# EAGLE design tello_ankle_encoder_and_amplifier-Symmetric (EAGLE 9.6.2)

## Sheet 1 of 6
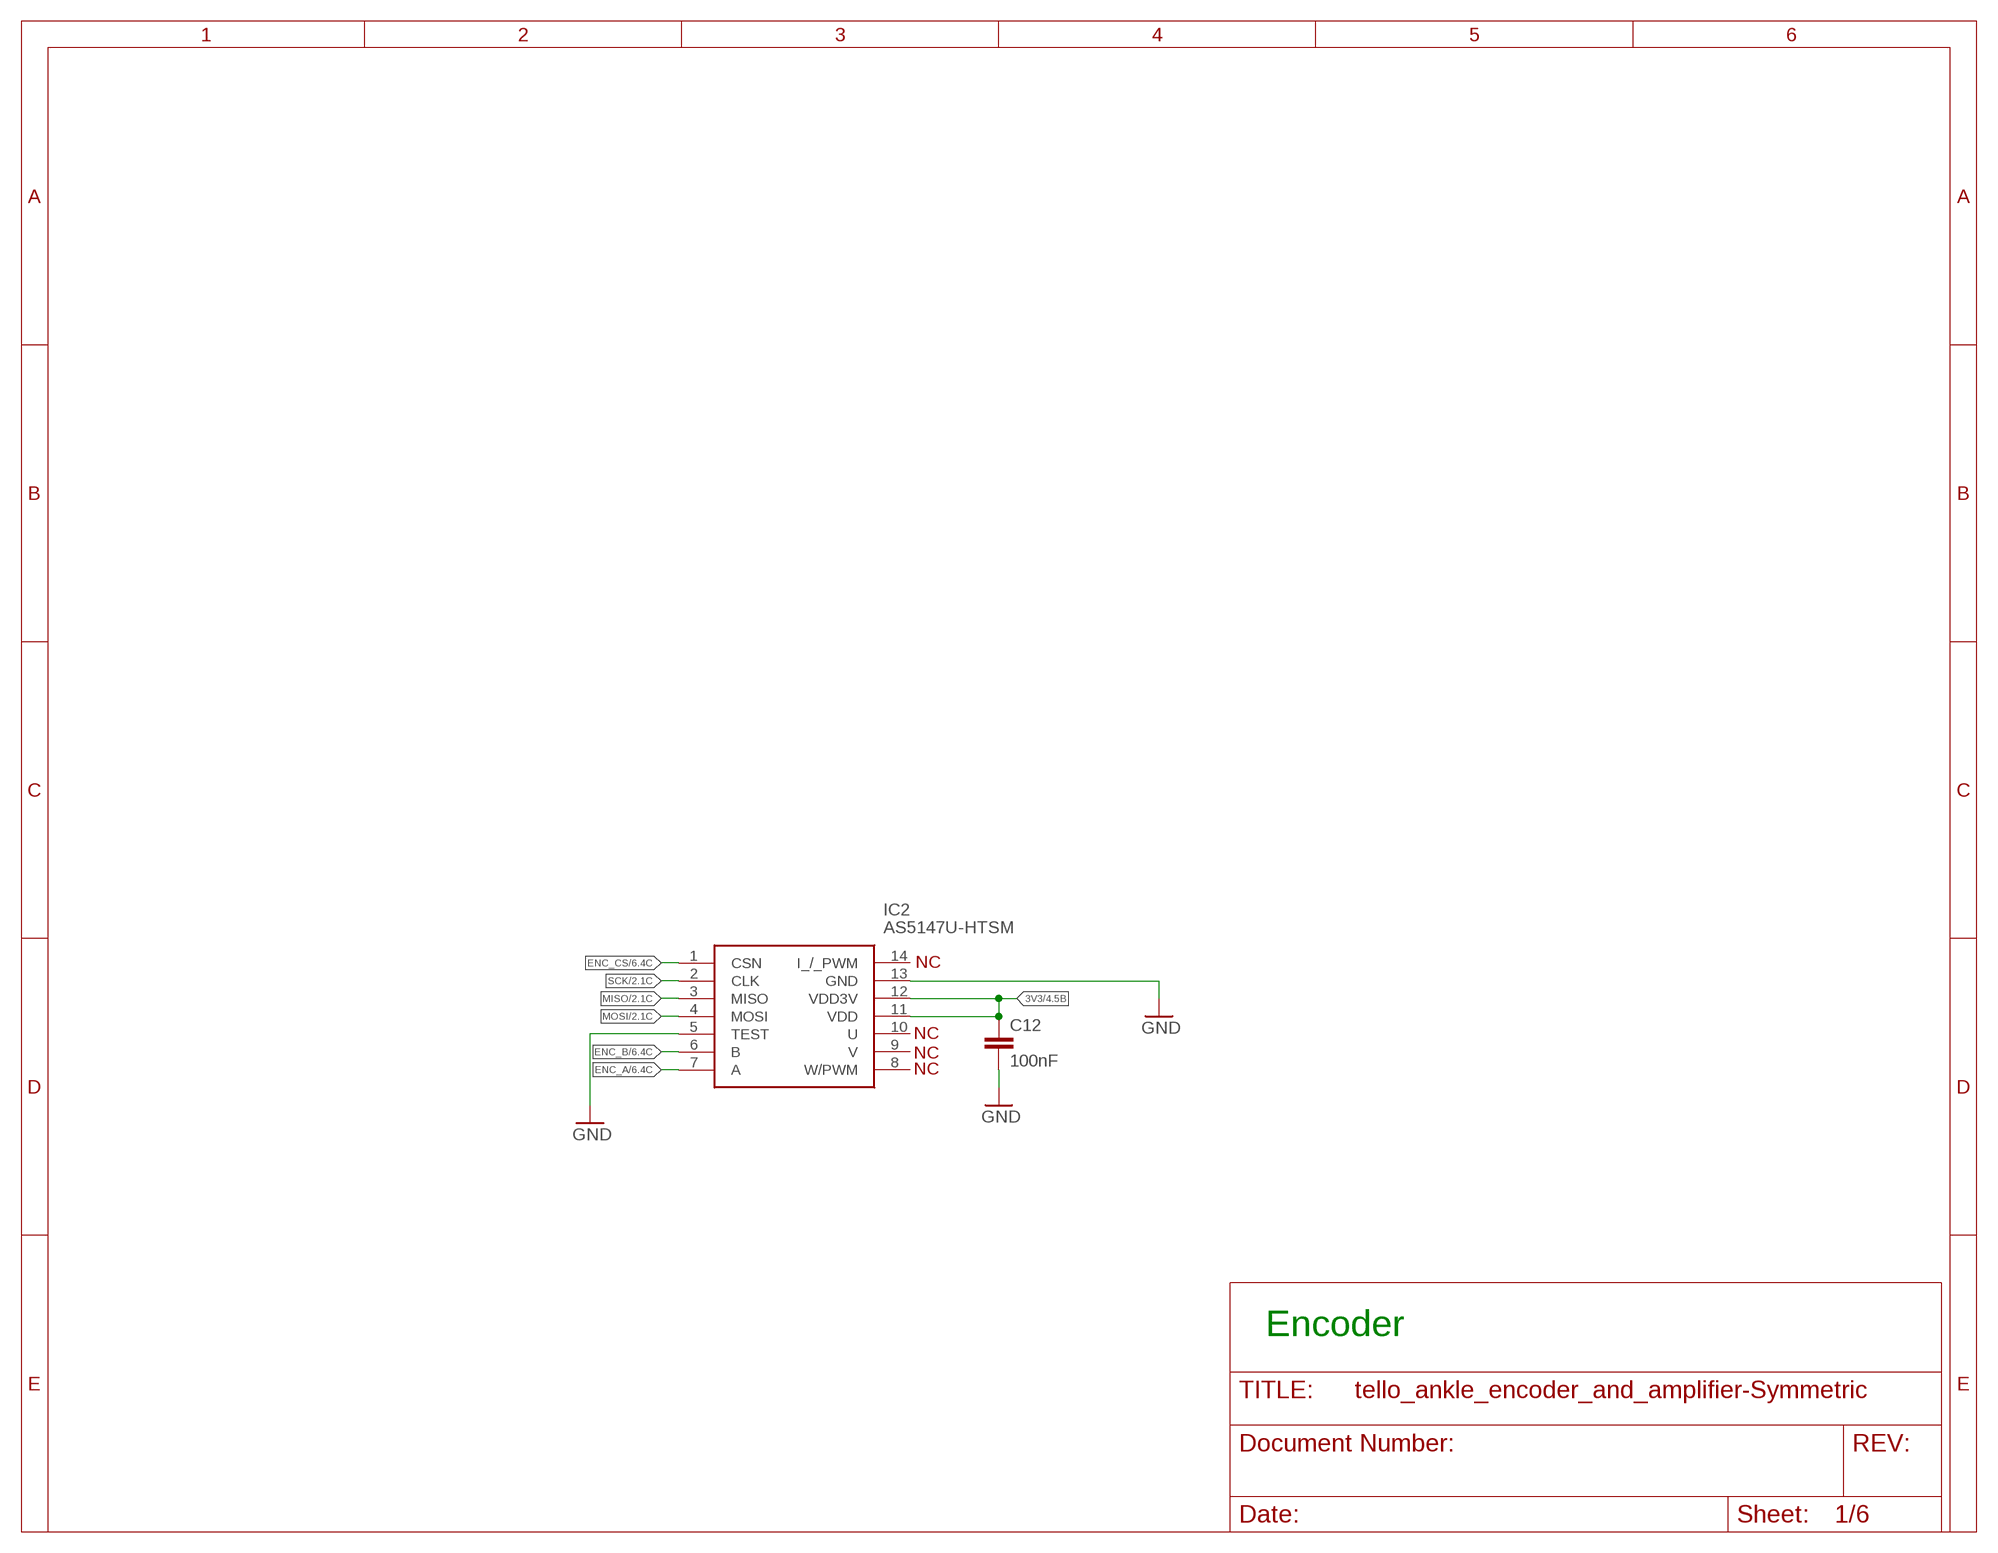
[diagram p0: schematic, sheet 1]

### Parts
C12  100nF  C-EUC0402  [C0402]
IC2  AS5147U-HTSM  [SOP65P640X120-14N]

### Nets
3V3: C12.1 IC2.11(VDD) IC2.12(VDD3V) ; also sheet 2,3,4,5,6
ENC_A: IC2.7(A) ; also sheet 6
ENC_B: IC2.6(B) ; also sheet 6
ENC_CS: IC2.1(CSN) ; also sheet 6
GND: C12.2 IC2.5(TEST) IC2.13(GND) ; also sheet 2,3,4,5,6
MISO: IC2.3(MISO) ; also sheet 2,3,6
MOSI: IC2.4(MOSI) ; also sheet 2,3,6
SCK: IC2.2(CLK) ; also sheet 2,3,6
Unconnected: IC2.8(W/PWM) IC2.9(V) IC2.10(U) IC2.14(I_/_PWM)

### Notes on the sheet
- NC
- NC
- NC
- NC
- Encoder

## Sheet 2 of 6
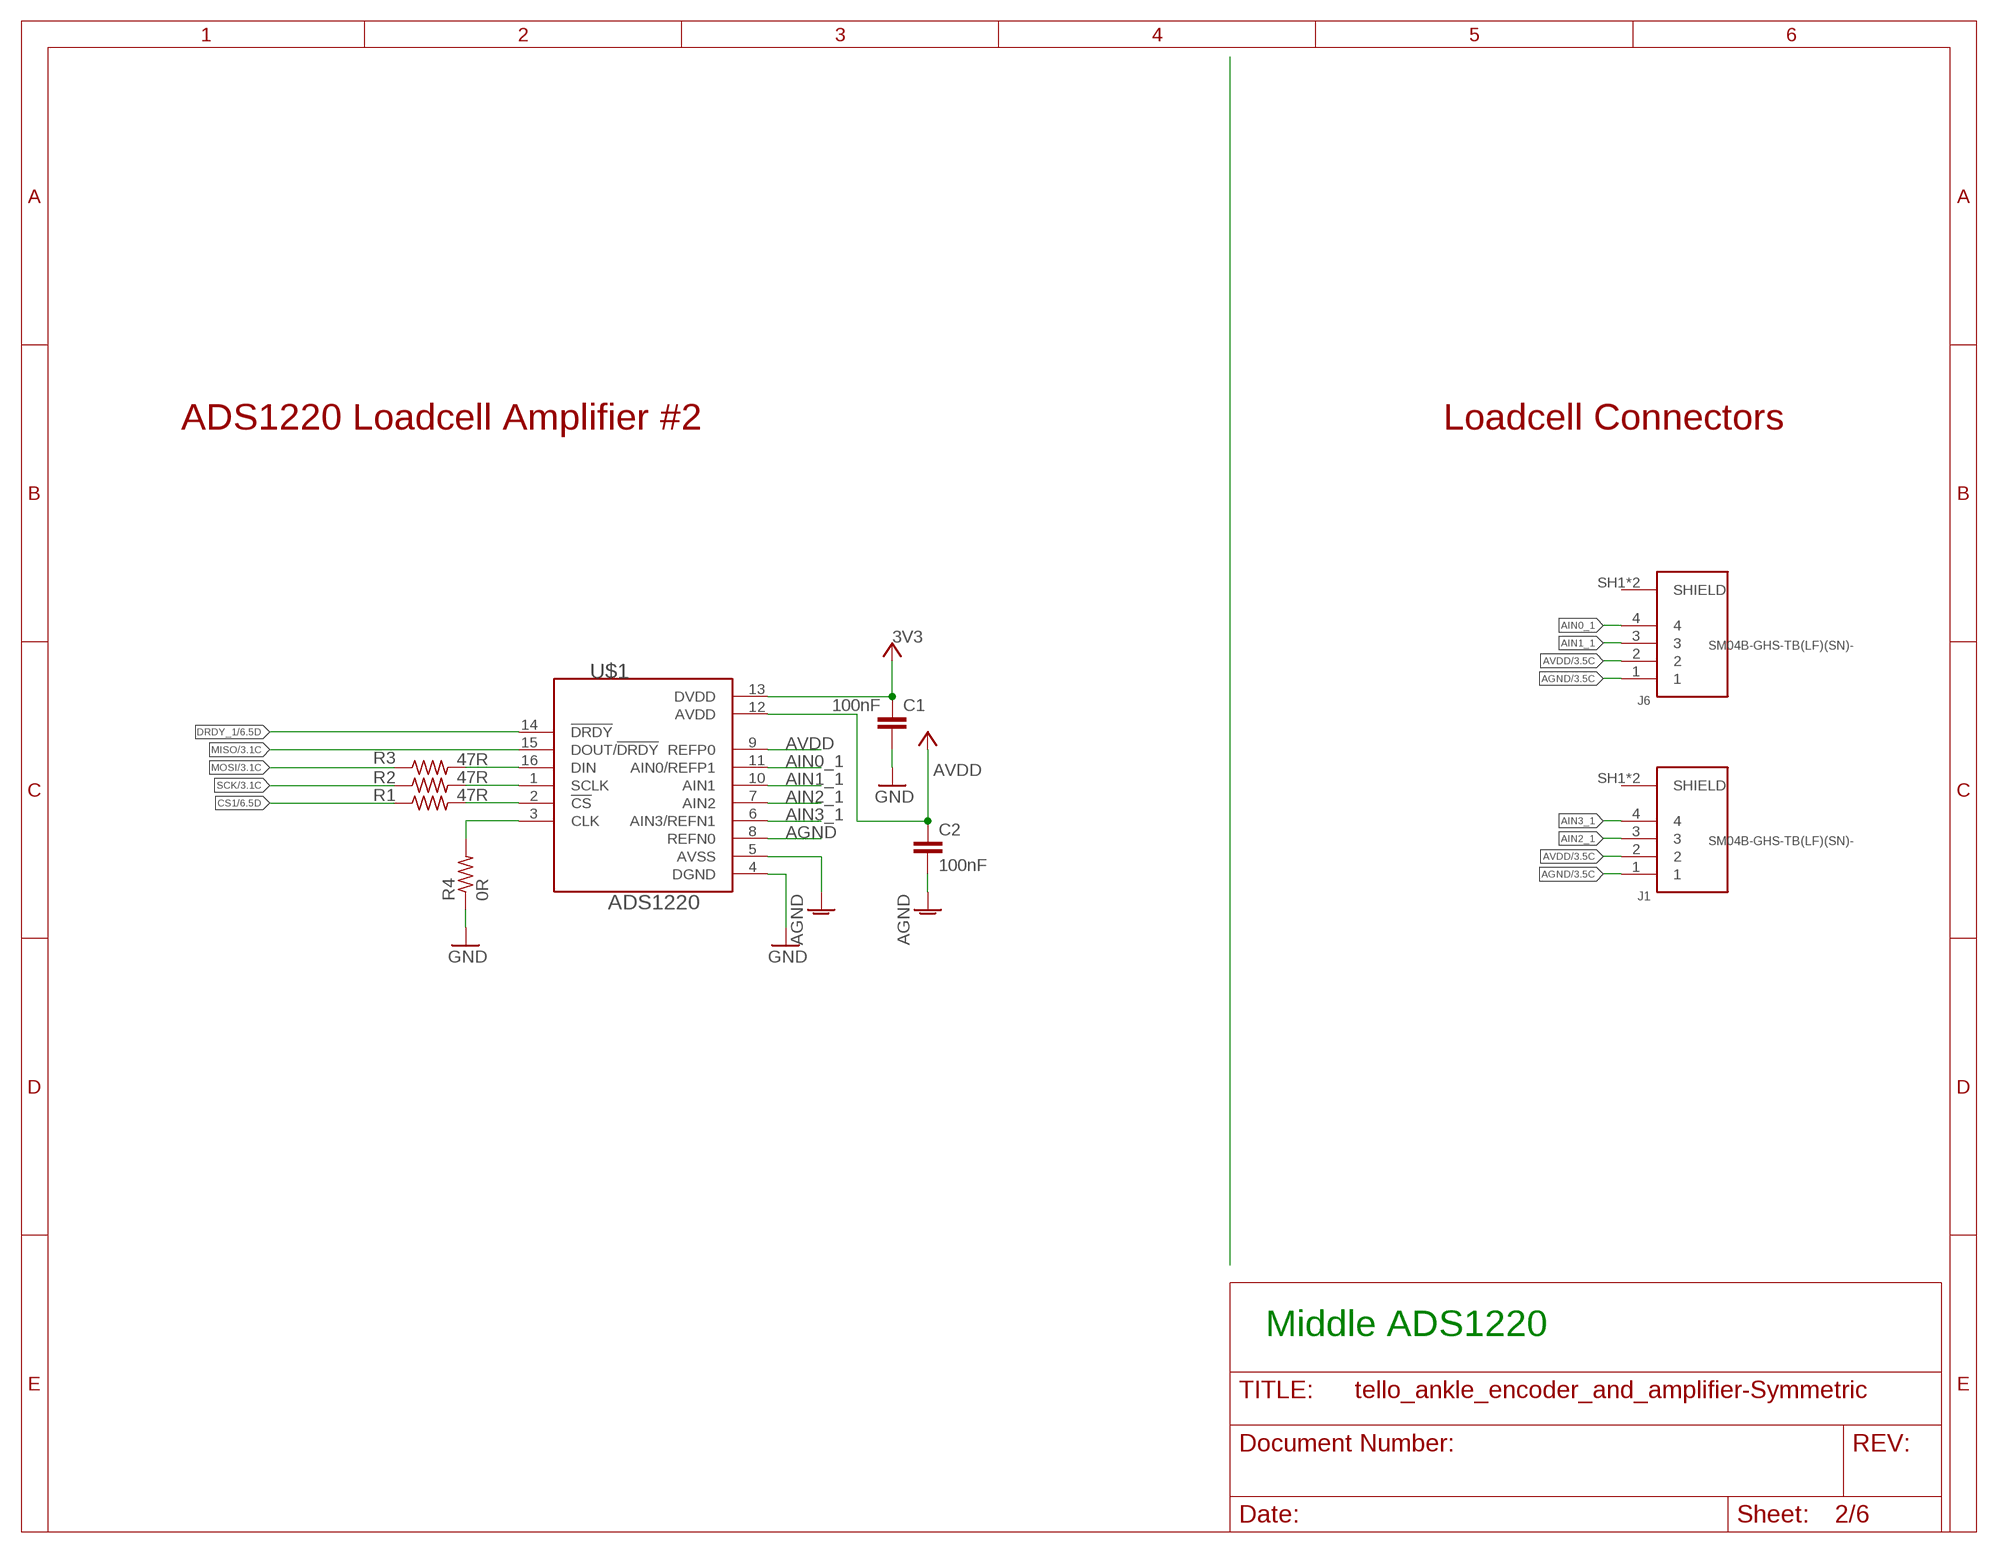
[diagram p1: schematic, sheet 2]

### Parts
C1  100nF  C-EUC0402  [C0402]
C2  100nF  C-EUC0402  [C0402]
J1  SM04B-GHS-TB(LF)(SN)-  [JST_SM04B-GHS-TB(LF)(SN)-]
J6  SM04B-GHS-TB(LF)(SN)-  [JST_SM04B-GHS-TB(LF)(SN)-]
R1  47R  R-US_R0402  [R0402]
R2  47R  R-US_R0402  [R0402]
R3  47R  R-US_R0402  [R0402]
R4  0R  R-US_R0402  [R0402]
U$1  ADS1220  [TSSOP-16]

### Nets
3V3: C1.1 U$1.13(DVDD) ; supply symbol labelled VCC ; also sheet 1,3,4,5,6
AGND: C2.2 J1.1 J6.1 U$1.5(AVSS) U$1.8(REFN0) ; also sheet 3
AIN0_1: J6.4 U$1.11(AIN0/REFP1)
AIN1_1: J6.3 U$1.10(AIN1)
AIN2_1: J1.3 U$1.7(AIN2)
AIN3_1: J1.4 U$1.6(AIN3/REFN1)
AVDD: C2.1 J1.2 J6.2 U$1.9(REFP0) U$1.12(AVDD) ; supply symbol labelled +5V ; also sheet 3
CS1: R1.1 ; also sheet 6
DRDY_1: U$1.14(!DRDY) ; also sheet 6
GND: C1.2 R4.1 U$1.4(DGND) ; also sheet 1,3,4,5,6
MISO: U$1.15(DOUT/!DRDY) ; also sheet 1,3,6
MOSI: R3.1 ; also sheet 1,3,6
N$3: R3.2 U$1.16(DIN)
N$4: R2.2 U$1.1(SCLK)
N$5: R1.2 U$1.2(!CS)
N$7: R4.2 U$1.3(CLK)
SCK: R2.1 ; also sheet 1,3,6

### Notes on the sheet
- ADS1220 Loadcell Amplifier #2 | Loadcell Connectors
- Middle ADS1220

## Sheet 3 of 6
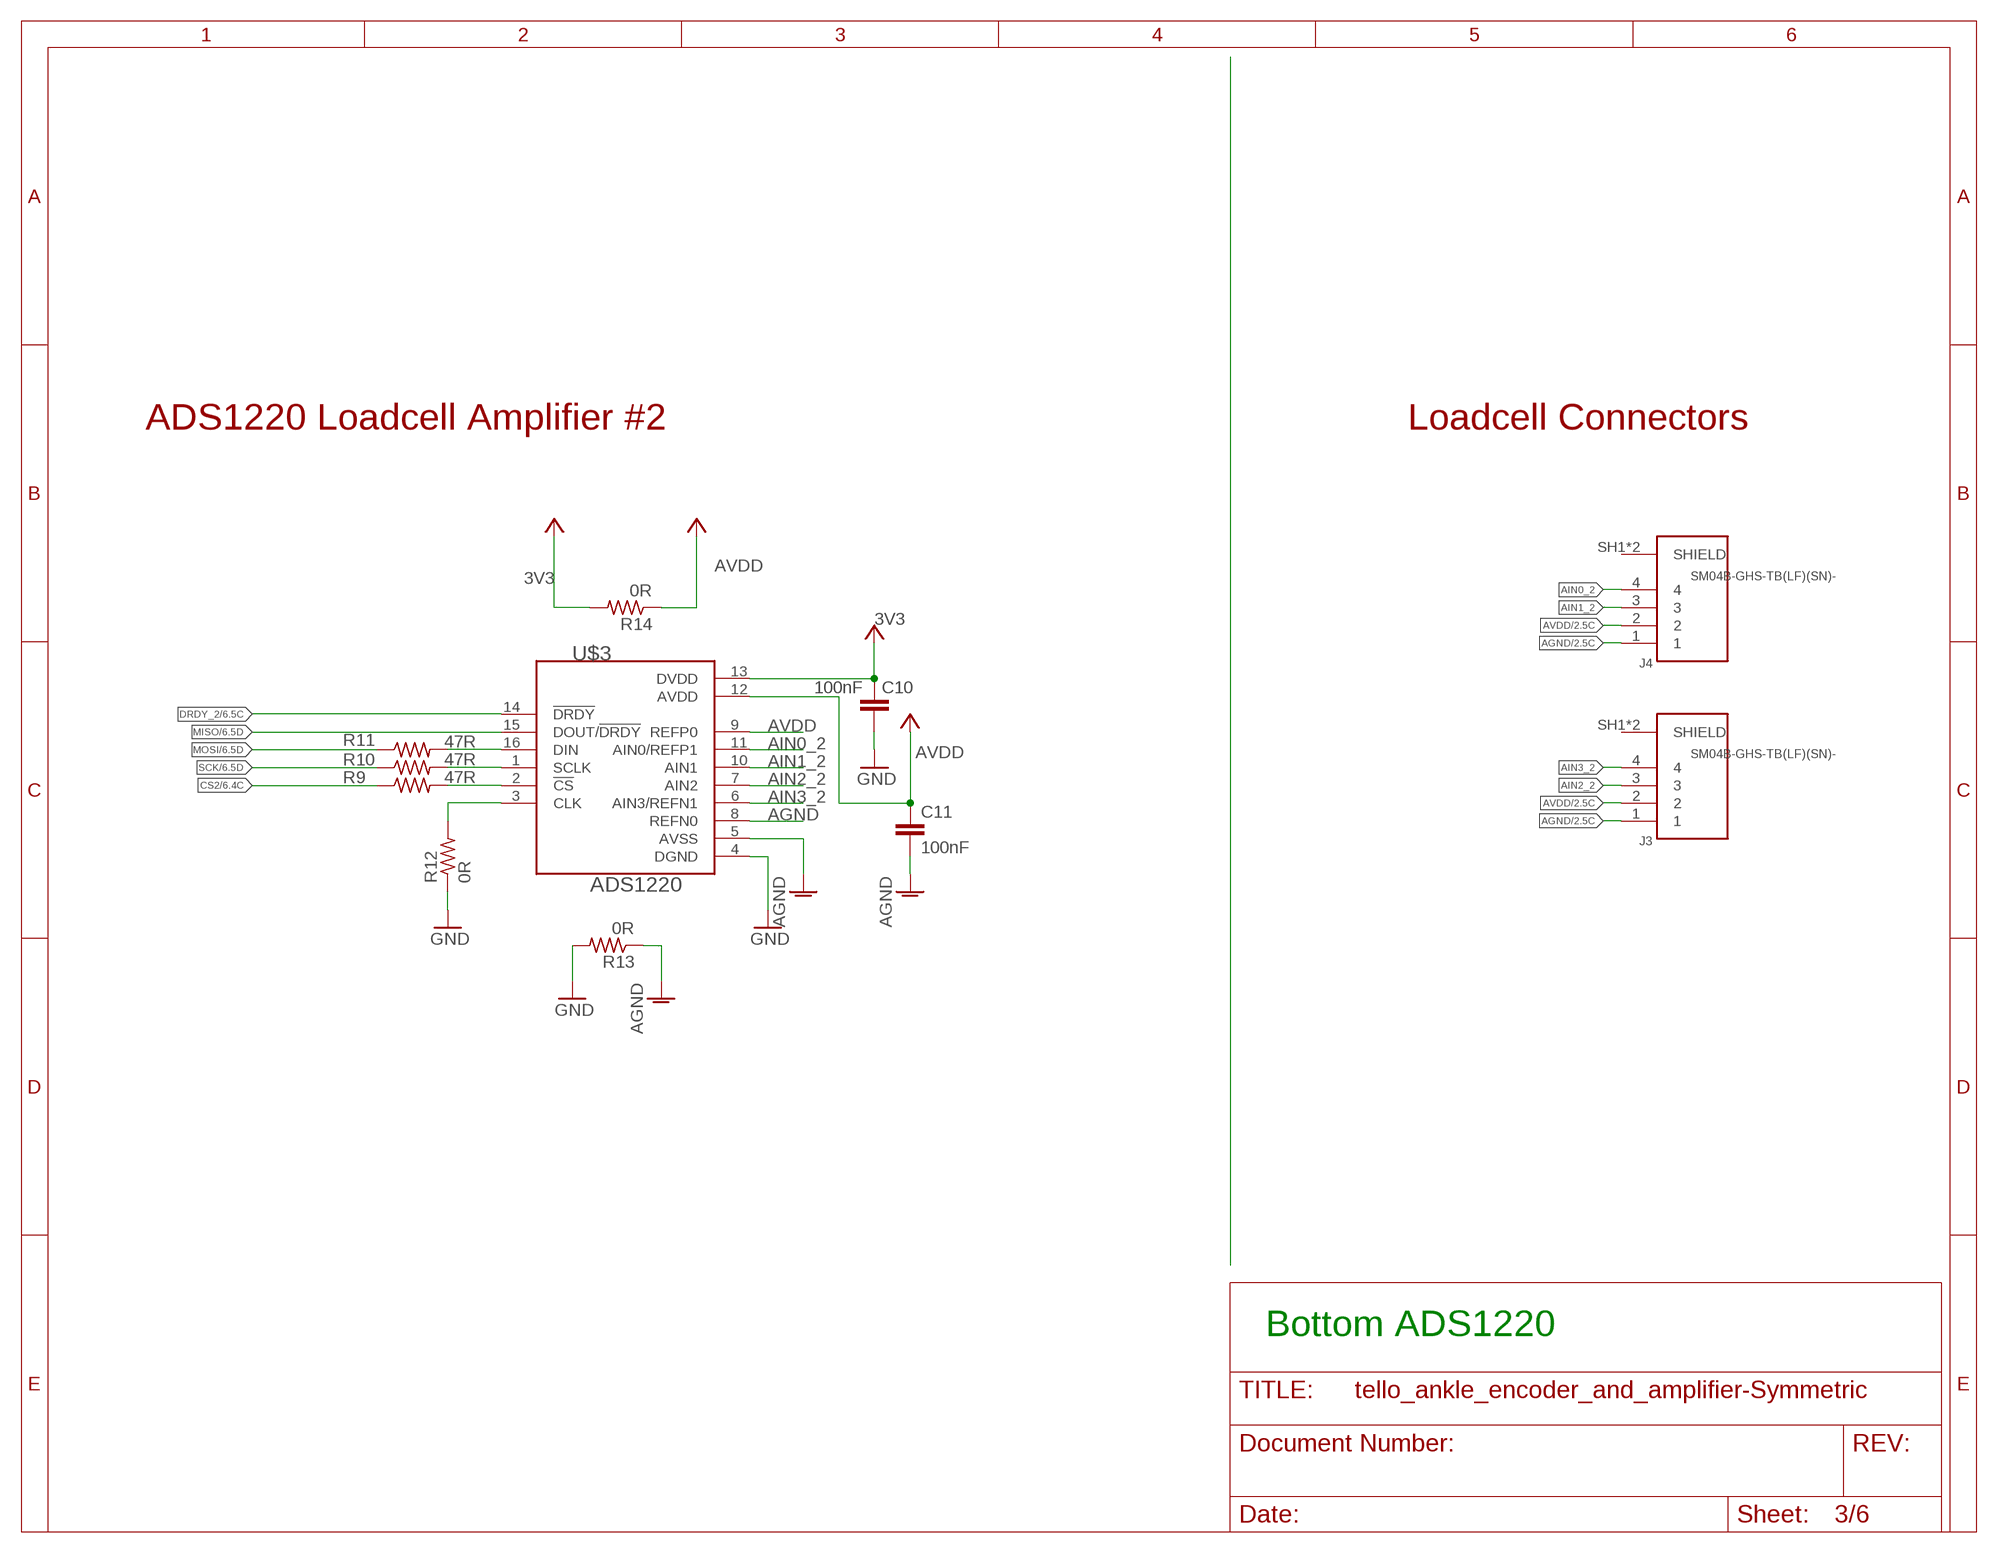
[diagram p2: schematic, sheet 3]

### Parts
C10  100nF  C-EUC0402  [C0402]
C11  100nF  C-EUC0402  [C0402]
J3  SM04B-GHS-TB(LF)(SN)-  [JST_SM04B-GHS-TB(LF)(SN)-]
J4  SM04B-GHS-TB(LF)(SN)-  [JST_SM04B-GHS-TB(LF)(SN)-]
R9  47R  R-US_R0402  [R0402]
R10  47R  R-US_R0402  [R0402]
R11  47R  R-US_R0402  [R0402]
R12  0R  R-US_R0402  [R0402]
R13  0R  R-US_R0402  [R0402]
R14  0R  R-US_R0402  [R0402]
U$3  ADS1220  [TSSOP-16]

### Nets
3V3: C10.1 R14.2 U$3.13(DVDD) ; supply symbol labelled VCC ; also sheet 1,2,4,5,6
AGND: C11.2 J3.1 J4.1 R13.1 U$3.5(AVSS) U$3.8(REFN0) ; also sheet 2
AIN0_2: J4.4 U$3.11(AIN0/REFP1)
AIN1_2: J4.3 U$3.10(AIN1)
AIN2_2: J3.3 U$3.7(AIN2)
AIN3_2: J3.4 U$3.6(AIN3/REFN1)
AVDD: C11.1 J3.2 J4.2 R14.1 U$3.9(REFP0) U$3.12(AVDD) ; supply symbol labelled +5V ; also sheet 2
CS2: R9.1 ; also sheet 6
DRDY_2: U$3.14(!DRDY) ; also sheet 6
GND: C10.2 R12.1 R13.2 U$3.4(DGND) ; also sheet 1,2,4,5,6
MISO: U$3.15(DOUT/!DRDY) ; also sheet 1,2,6
MOSI: R11.1 ; also sheet 1,2,6
N$1: R11.2 U$3.16(DIN)
N$2: R10.2 U$3.1(SCLK)
N$6: R9.2 U$3.2(!CS)
N$8: R12.2 U$3.3(CLK)
SCK: R10.1 ; also sheet 1,2,6

### Notes on the sheet
- ADS1220 Loadcell Amplifier #2 | Loadcell Connectors
- Bottom ADS1220

## Sheet 4 of 6
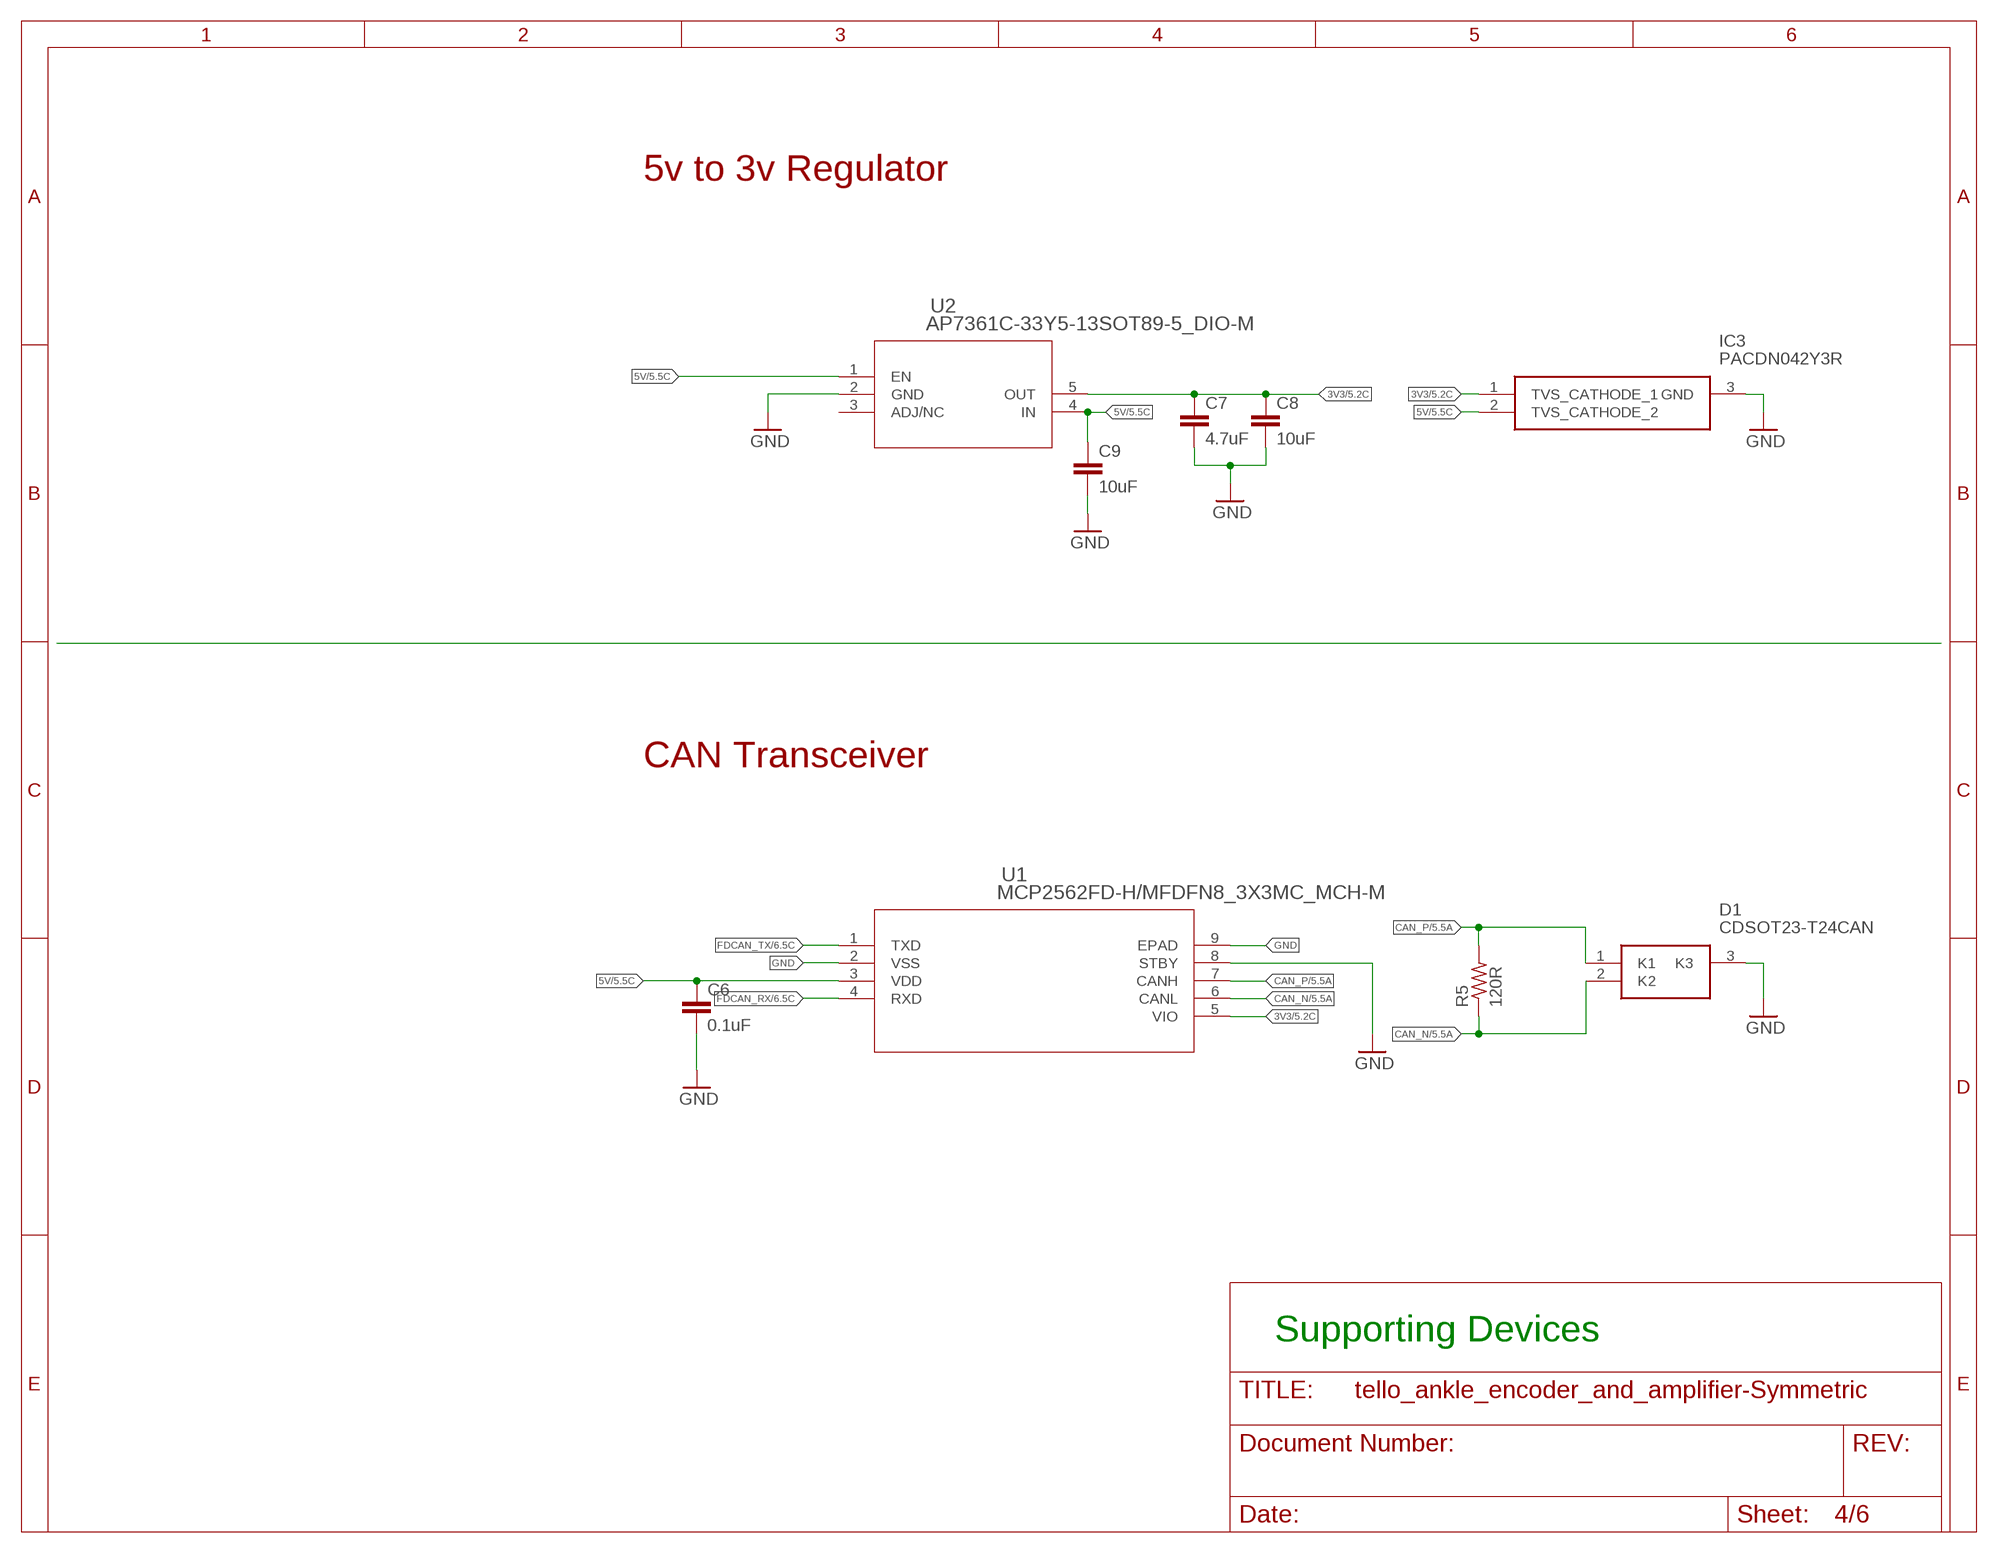
[diagram p3: schematic, sheet 4]

### Parts
C6  0.1uF  C-EUC0603  [C0603]
C7  4.7uF  C-EUC0603  [C0603]
C8  10uF  C-EUC0603  [C0603]
C9  10uF  C-EUC0603  [C0603]
D1  CDSOT23-T24CAN  [SOT95P230X117-3N]
IC3  PACDN042Y3R  [SOT96P237X111-3N]
R5  120R  R-US_R0402  [R0402]
U1  MCP2562FD-H/MFDFN8_3X3MC_MCH-M  [DFN8_3X3MC_MCH-M]
U2  AP7361C-33Y5-13SOT89-5_DIO-M  [SOT89-5_DIO-M]

### Nets
3V3: C7.1 C8.1 IC3.1(TVS_CATHODE_1) U1.5(VIO) U2.5(OUT) ; also sheet 1,2,3,5,6
5V: C6.1 C9.1 IC3.2(TVS_CATHODE_2) U1.3(VDD) U2.1(EN) U2.4(IN) ; also sheet 5
CAN_N [CAN]: D1.2(K2) R5.1 U1.6(CANL) ; also sheet 5
CAN_P [CAN]: D1.1(K1) R5.2 U1.7(CANH) ; also sheet 5
FDCAN_RX: U1.4(RXD) ; also sheet 6
FDCAN_TX: U1.1(TXD) ; also sheet 6
GND: C6.2 C7.2 C8.2 C9.2 D1.3(K3) IC3.3(GND) U1.2(VSS) U1.8(STBY) U1.9(EPAD) U2.2(GND) ; also sheet 1,2,3,5,6
Unconnected: U2.3(ADJ/NC)

### Notes on the sheet
- 5v to 3v Regulator
- CAN Transceiver
- Supporting Devices

## Sheet 5 of 6
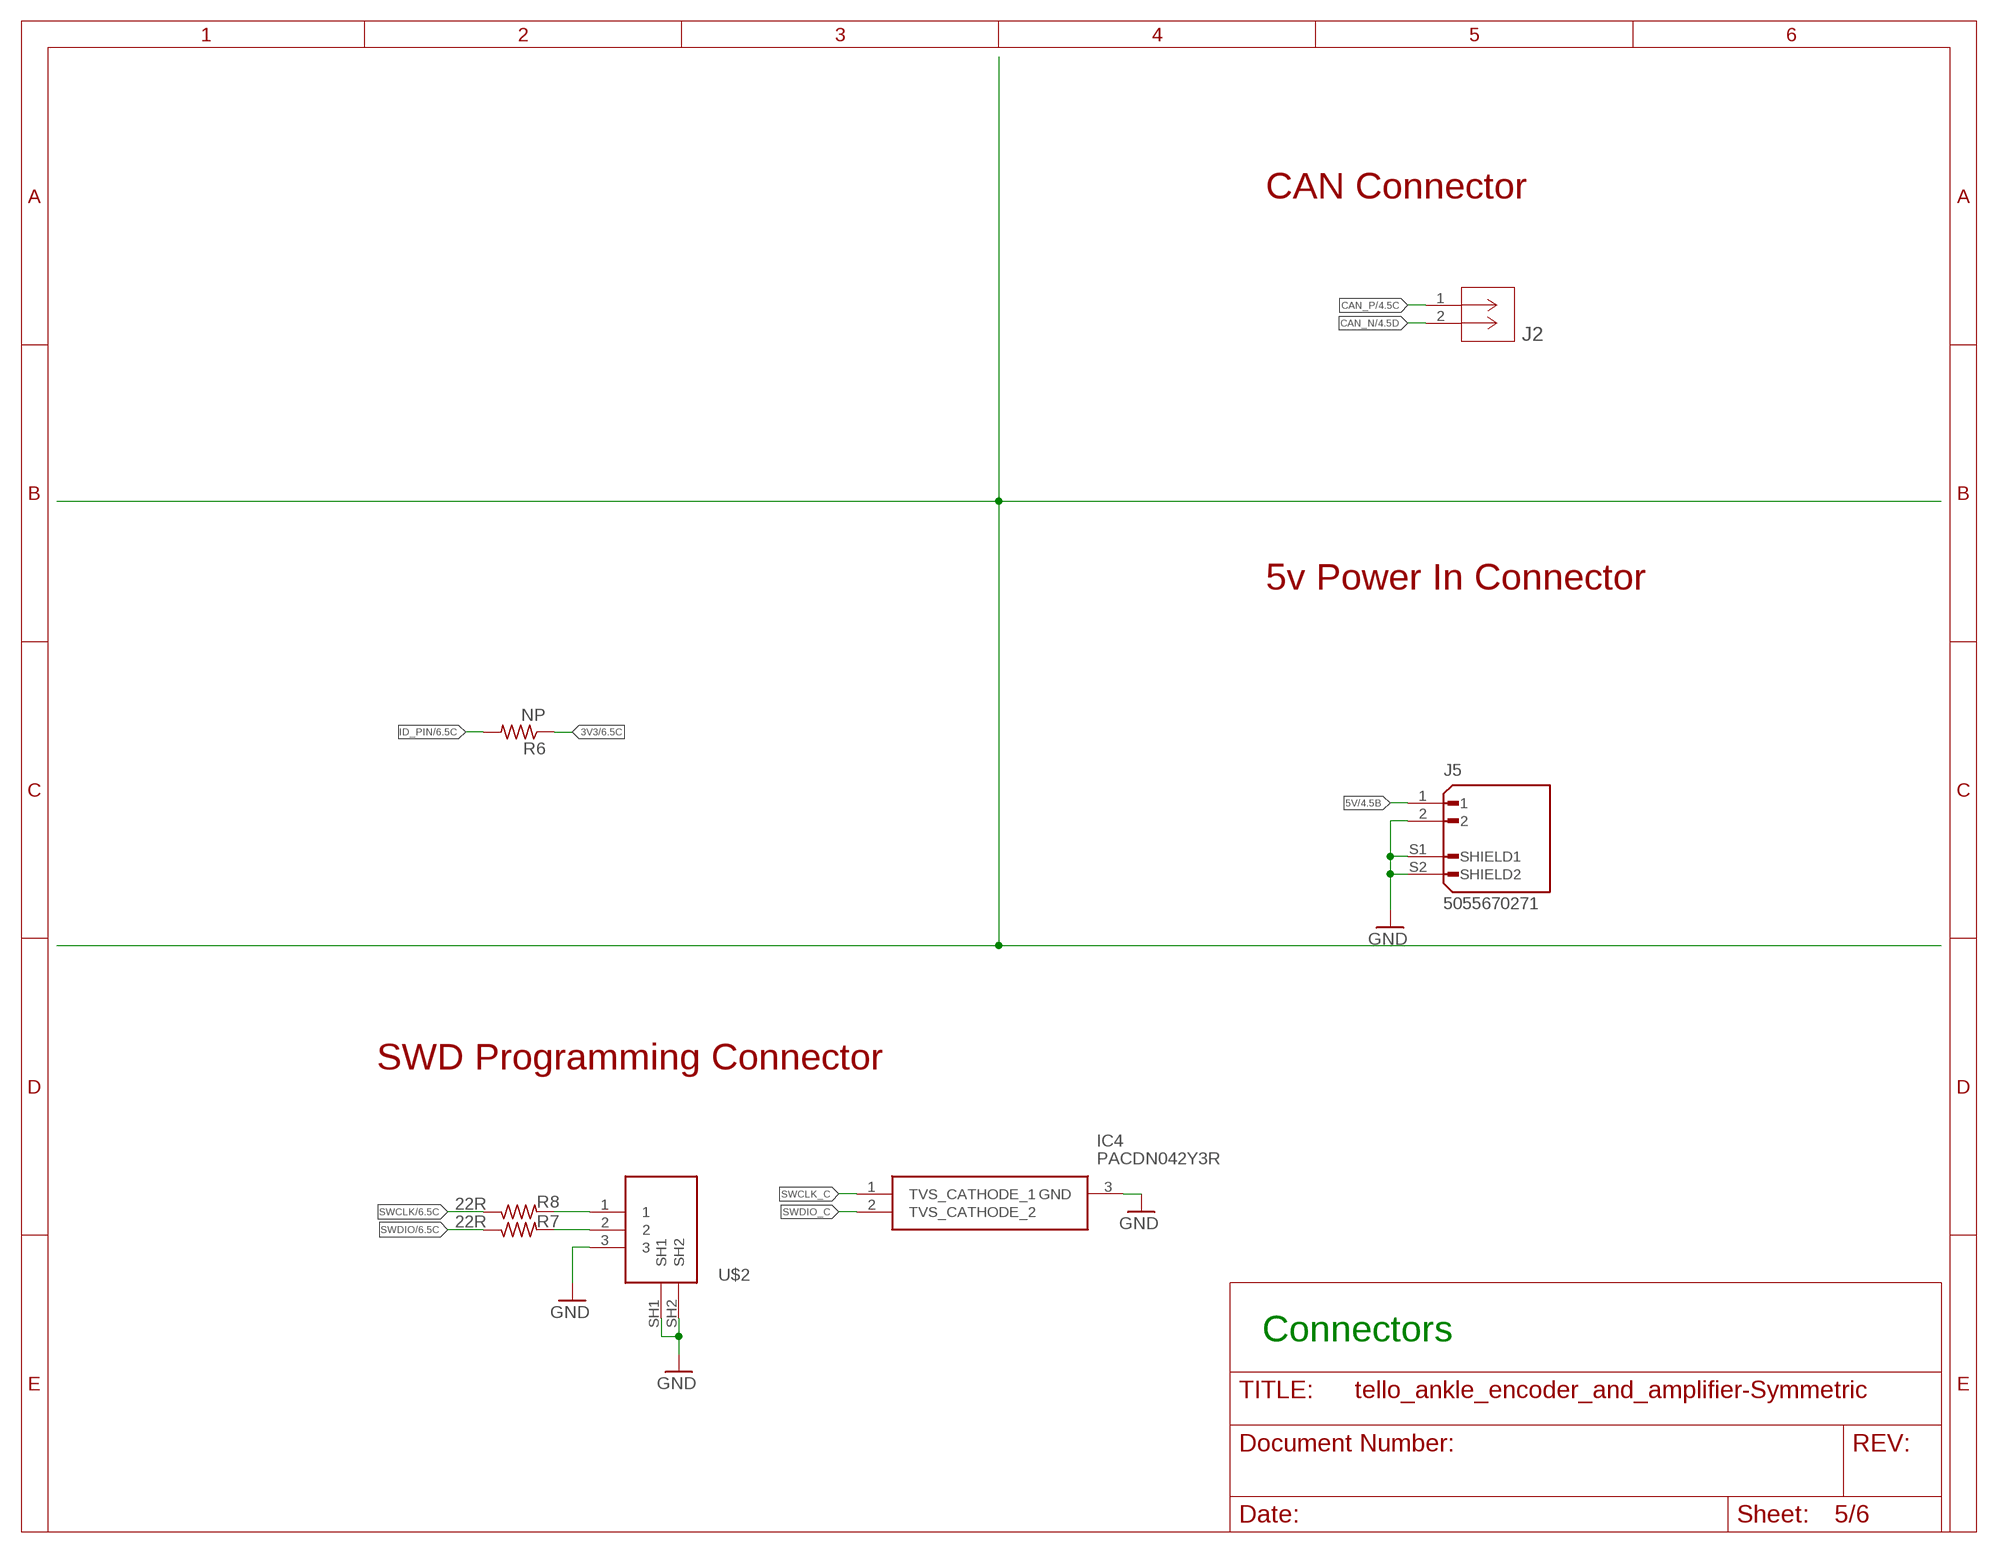
[diagram p4: schematic, sheet 5]

### Parts
IC4  PACDN042Y3R  [SOT96P237X111-3N]
J2  SM02BGHSTBLFSN  [CONN_SM02BGHSTB_JST]
J5  5055670271  [MOLEX_5055670271]
R6  NP  R-US_R0402  [R0402]
R7  22R  R-US_R0402  [R0402]
R8  22R  R-US_R0402  [R0402]
U$2  125SH-G-03-TR-SMT  [125SH-G-03-TR-SMT]

### Nets
3V3: R6.1 ; also sheet 1,2,3,4,6
5V: J5.1 ; also sheet 4
CAN_N [CAN]: J2.2 ; also sheet 4
CAN_P [CAN]: J2.1 ; also sheet 4
GND: IC4.3(GND) J5.2 J5.S1(SHIELD1) J5.S2(SHIELD2) U$2.3 U$2.SH1 U$2.SH2 ; also sheet 1,2,3,4,6
ID_PIN: R6.2 ; also sheet 6
SWCLK: R8.1 ; also sheet 6
SWCLK_C: IC4.1(TVS_CATHODE_1) R8.2 U$2.1
SWDIO: R7.1 ; also sheet 6
SWDIO_C: IC4.2(TVS_CATHODE_2) R7.2 U$2.2

### Notes on the sheet
- CAN Connector
- 5v Power In Connector
- SWD Programming Connector
- U$2
- Connectors

## Sheet 6 of 6
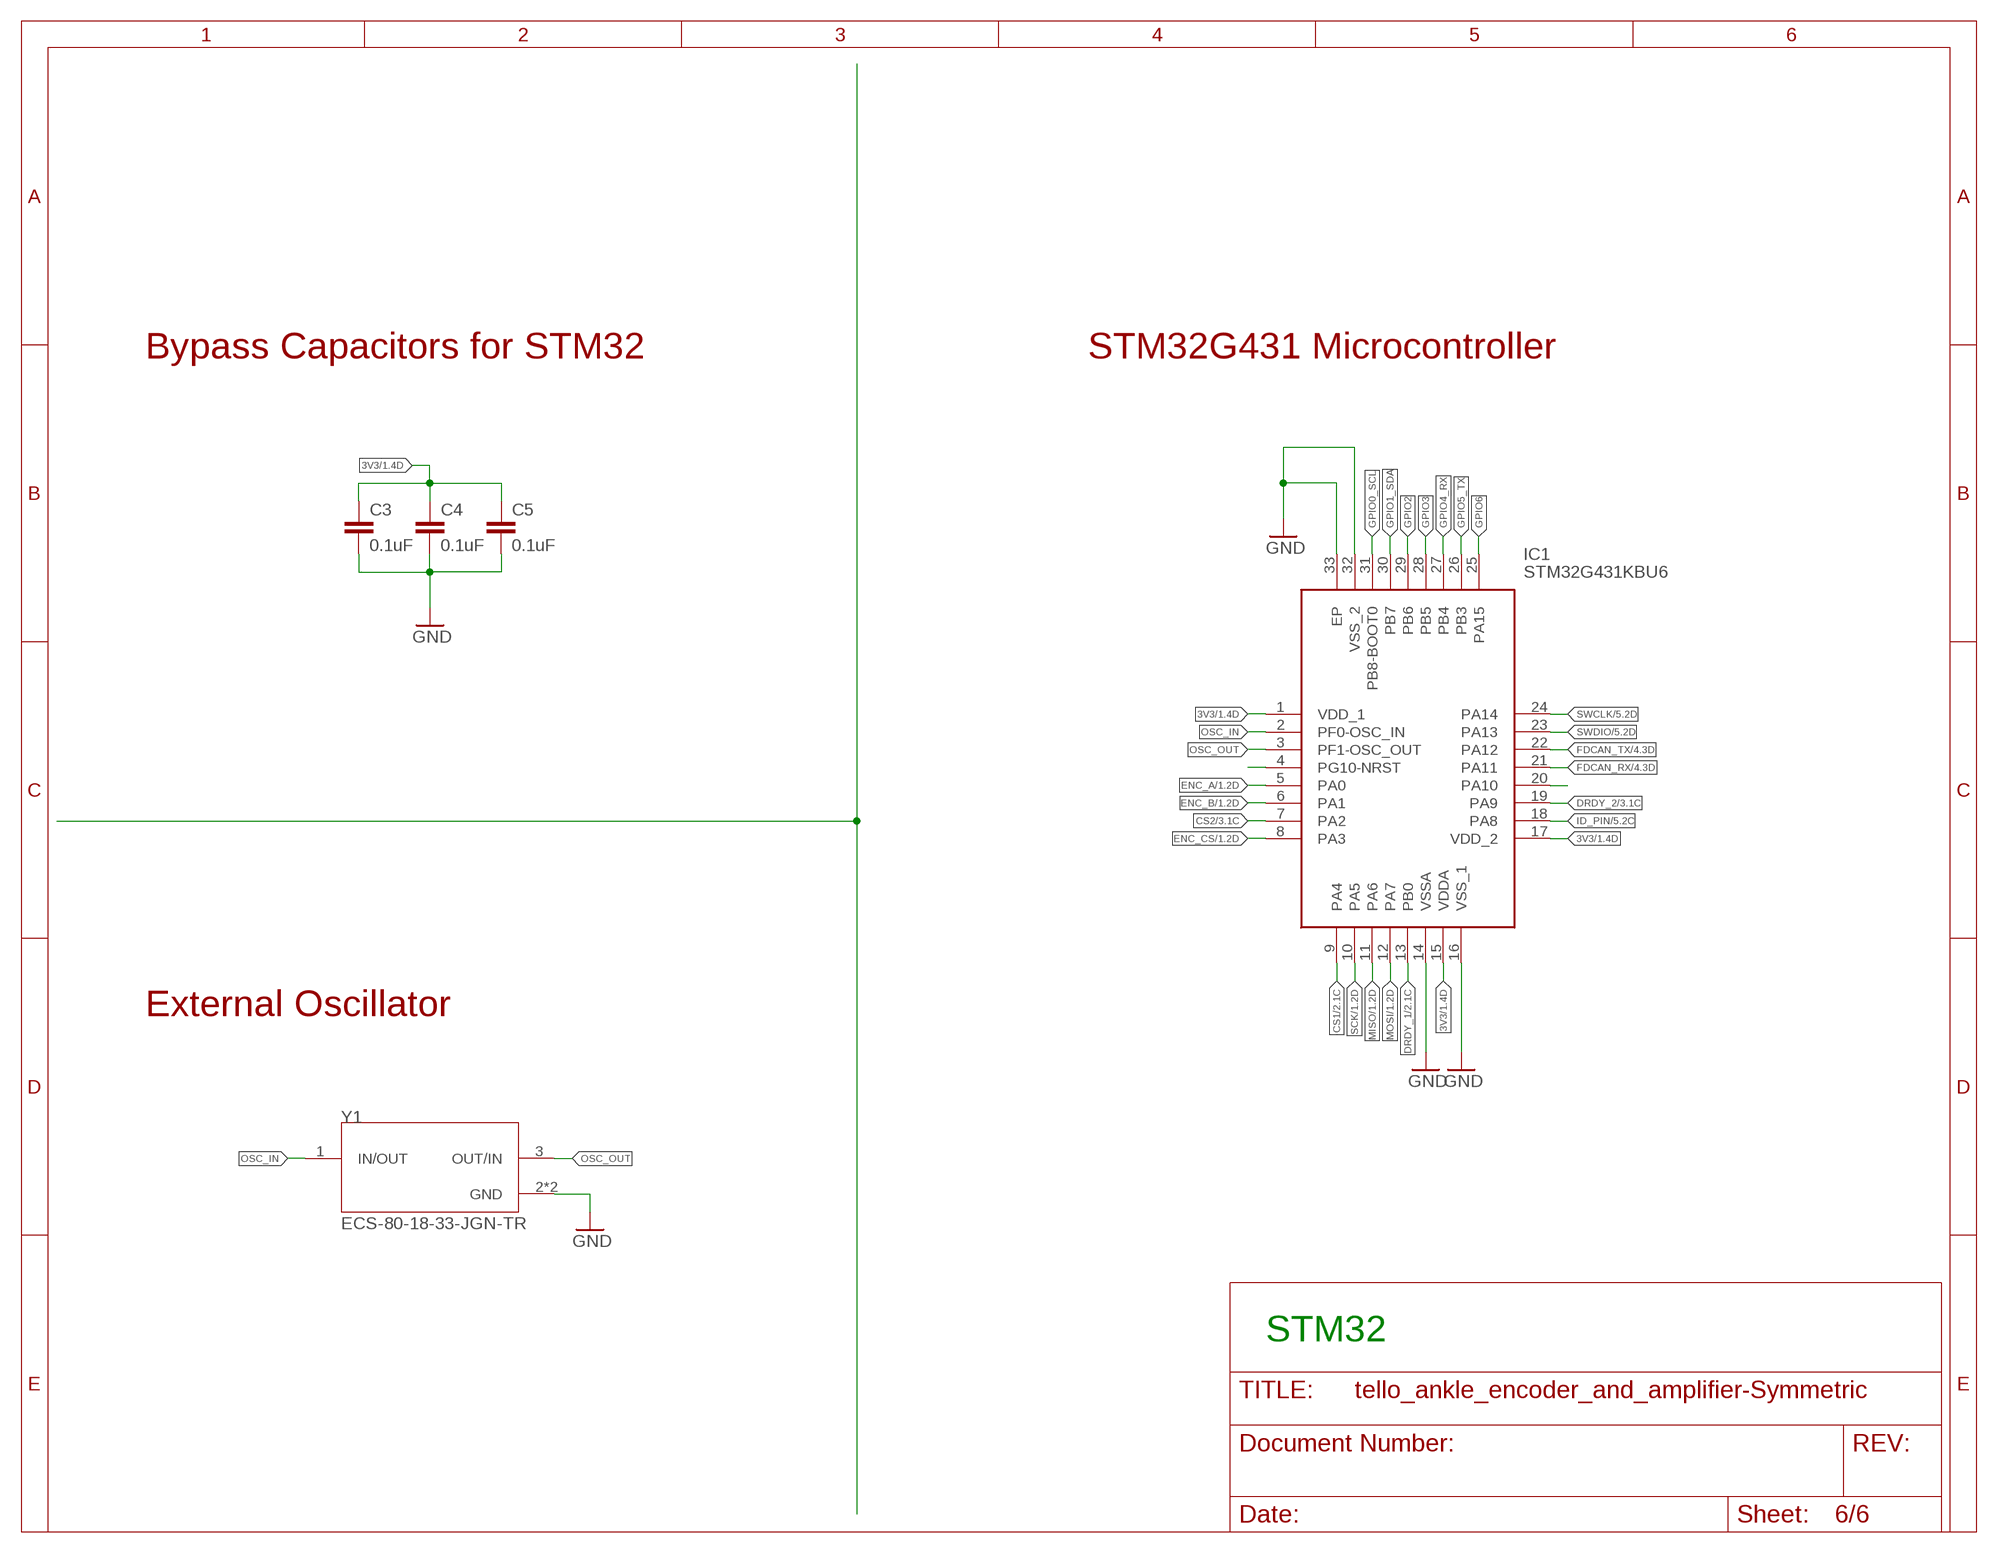
[diagram p5: schematic, sheet 6]

### Parts
C3  0.1uF  C-EUC0402  [C0402]
C4  0.1uF  C-EUC0402  [C0402]
C5  0.1uF  C-EUC0402  [C0402]
IC1  STM32G431KBU6  [QFN50P500X500X60-33N]
Y1  ECS-80-18-33-JGN-TR  [XTAL_ECS-240-8-33-AGN-TR]

### Nets
3V3: C3.1 C4.1 C5.1 IC1.1(VDD_1) IC1.15(VDDA) IC1.17(VDD_2) ; also sheet 1,2,3,4,5
CS1: IC1.9(PA4) ; also sheet 2
CS2: IC1.7(PA2) ; also sheet 3
DRDY_1: IC1.13(PB0) ; also sheet 2
DRDY_2: IC1.19(PA9) ; also sheet 3
ENC_A: IC1.5(PA0) ; also sheet 1
ENC_B: IC1.6(PA1) ; also sheet 1
ENC_CS: IC1.8(PA3) ; also sheet 1
FDCAN_RX: IC1.21(PA11) ; also sheet 4
FDCAN_TX: IC1.22(PA12) ; also sheet 4
GND: C3.2 C4.2 C5.2 IC1.14(VSSA) IC1.16(VSS_1) IC1.32(VSS_2) IC1.33(EP) Y1.2(GND) Y1.4(GND) ; also sheet 1,2,3,4,5
GPIO0_SCL: IC1.31(PB8-BOOT0)
GPIO1_SDA: IC1.30(PB7)
GPIO2: IC1.29(PB6)
GPIO3: IC1.28(PB5)
GPIO4_RX: IC1.27(PB4)
GPIO5_TX: IC1.26(PB3)
GPIO6: IC1.25(PA15)
ID_PIN: IC1.18(PA8) ; also sheet 5
MISO: IC1.11(PA6) ; also sheet 1,2,3
MOSI: IC1.12(PA7) ; also sheet 1,2,3
N$12: IC1.4(PG10-NRST)
N$28: IC1.20(PA10)
OSC_IN: IC1.2(PF0-OSC_IN) Y1.1(IN/OUT)
OSC_OUT: IC1.3(PF1-OSC_OUT) Y1.3(OUT/IN)
SCK: IC1.10(PA5) ; also sheet 1,2,3
SWCLK: IC1.24(PA14) ; also sheet 5
SWDIO: IC1.23(PA13) ; also sheet 5

### Notes on the sheet
- Bypass Capacitors for STM32 | STM32G431 Microcontroller
- External Oscillator
- STM32

## Power pins joined to a net without a drawn wire
SHIELD: J1.SH1(SHIELD) J1.SH2(SHIELD) J3.SH1(SHIELD) J3.SH2(SHIELD) J4.SH1(SHIELD) J4.SH2(SHIELD) J6.SH1(SHIELD) J6.SH2(SHIELD)

## Library data of the parts
C1-C12 = rcl:C-EU: CAPACITOR, European symbol; SPICEPREFIX: C
D1 = CDSOT23-T24CAN:CDSOT23-T24CAN: Bourns CDSOT23-T24CAN, Dual Bi-Directional ESD Protection Diode, 3-Pin SOT-23 Source: Datasheet <https://www.bourns.com/docs/Product-Datasheets/CDSOT23-T24CAN.pdf>; ARROW_PART_NUMBER: CDSOT23-T24CAN; ARROW_PRICE-STOCK: https://www.arrow.com/en/products/cdsot23-t24can/bourns?region=nac; DESCRIPTION: Bourns CDSOT23-T24CAN, Dual Bi-Directional ESD Protection Diode, 3-Pin SOT-23; HEIGHT: 1.17mm; MANUFACTURER_NAME: Bourns; MANUFACTURER_PART_NUMBER: CDSOT23-T24CAN; MOUSER_PART_NUMBER: 652-CDSOT23-T24CAN; MOUSER_PRICE-STOCK: https://www.mouser.co.uk/ProductDetail/Bourns/CDSOT23-T24CAN?qs=Z7P4xsdcg2LuAOb%2FzQ7xoQ%3D%3D
IC1 = STM32G431KBU6:STM32G431KBU6: STMICROELECTRONICS - STM32G431KBU6 - MCU, 32BIT, 170MHZ, UFQFPN-32 Source: Datasheet <https://www.st.com/resource/en/datasheet/stm32g431kb.pdf>; ARROW_PART_NUMBER: STM32G431KBU6; ARROW_PRICE-STOCK: https://www.arrow.com/en/products/stm32g431kbu6/stmicroelectronics?region=nac; DESCRIPTION: STMICROELECTRONICS - STM32G431KBU6 - MCU, 32BIT, 170MHZ, UFQFPN-32; HEIGHT: 0.6mm; MANUFACTURER_NAME: STMicroelectronics; MANUFACTURER_PART_NUMBER: STM32G431KBU6; MOUSER_PART_NUMBER: 511-STM32G431KBU6; MOUSER_PRICE-STOCK: https://www.mouser.co.uk/ProductDetail/STMicroelectronics/STM32G431KBU6?qs=T3oQrply3y%2Frk9w4R%2FCLxg%3D%3D
IC2 = AS5147U-HTSM:AS5147U-HTSM: Board Mount Hall Effect / Magnetic Sensors 14-Bit Dual-Die On-Axis Magnetic Rotary Position Sensor with Up to 14-Bit Binary Incremental Pulse Count Source: Datasheet <https://ams.com/documents/20143/36005/AS5147_DS000307_3-00.pdf>; ARROW_PART_NUMBER: AS5147U-HTSM; ARROW_PRICE-STOCK: https://www.arrow.com/en/products/as5147u-htsm/ams-ag?region=nac; DESCRIPTION: Board Mount Hall Effect / Magnetic Sensors 14-Bit Dual-Die On-Axis Magnetic Rotary Position Sensor with Up to 14-Bit Binary Incremental Pulse Count; HEIGHT: 1.2mm; MANUFACTURER_NAME: ams; MANUFACTURER_PART_NUMBER: AS5147U-HTSM; MOUSER_PART_NUMBER: 985-AS5147U-HTSM; MOUSER_PRICE-STOCK: https://www.mouser.co.uk/ProductDetail/ams/AS5147U-HTSM?qs=vLWxofP3U2ztCxAO5c%252BNHw%3D%3D
IC3 IC4 = PACDN042Y3R:PACDN042Y3R: Transient Voltage Suppressors and ESD Protectors Source: Datasheet <http://www.onsemi.com/pub/Collateral/PACDN042-D.PDF>; ARROW_PART_NUMBER: PACDN042Y3R; ARROW_PRICE-STOCK: https://www.arrow.com/en/products/pacdn042y3r/on-semiconductor; DESCRIPTION: Transient Voltage Suppressors and ESD Protectors; HEIGHT: 1.11mm; MANUFACTURER_NAME: onsemi; MANUFACTURER_PART_NUMBER: PACDN042Y3R; MOUSER_PART_NUMBER: 748-PACDN042Y3R; MOUSER_PRICE-STOCK: https://www.mouser.co.uk/ProductDetail/onsemi/PACDN042Y3R?qs=XcCBWJCwUGxb%252B%252BFbMKkIDQ%3D%3D
J1 J3 J4 J6 = SM04B-GHS-TB_LF__SN_-:SM04B-GHS-TB(LF)(SN)-: Conn Header Gh Side 4pos 1.25mm; DESCRIPTION: Connector Header Surface Mount, Right Angle 4 position 0.049 (1.25mm); DIGI-KEY_PART_NUMBER: 455-1566-2-ND; MF: JST Sales; MP: SM04B-GHS-TB(LF)(SN)-; PACKAGE: None; PURCHASE-URL: https://pricing.snapeda.com/search/part/SM04B-GHS-TB(LF)(SN)-/?ref=eda
J2 = SM02B-GHS-TB:SM02BGHSTBLFSN; COPYRIGHT: Copyright (C) 2022 Ultra Librarian. All rights reserved.; DIGI-KEY_PART_NUMBER_1: 455-1564-2-ND; DIGI-KEY_PART_NUMBER_2: 455-1564-1-ND; DIGI-KEY_PART_NUMBER_3: 455-1564-6-ND; MANUFACTURER_PART_NUMBER: SM02BGHSTBLFSN; MFR_NAME: JST
J5 = 5055670271:5055670271: 1.25mm Pitch, Micro-Lock Plus PCB Header, Right-Angle, Surface Mount, 0.38µm Gold Plating, Positive Lock, 2 Circuits, Black; MANUFACTURER: Molex; MAXIMUM_PACKAGE_HEIGHT: 3.9 mm; PARTREV: C; STANDARD: Manufacturer Recommendations
R1-R14 = rcl:R-US_: RESISTOR, American symbol; SPICEPREFIX: R
U1 = MCP2562FD:MCP2562FD-H/MF; COPYRIGHT: Copyright (C) 2023 Ultra Librarian. All rights reserved.; MANUFACTURER_PART_NUMBER: MCP2562FD-H/MF; MFR_NAME: Microchip
U2 = AP7361C-33Y5-13:AP7361C-33Y5-13; COPYRIGHT: Copyright (C) 2023 Ultra Librarian. All rights reserved.; MANUFACTURER_PART_NUMBER: AP7361C-33Y5-13; MFR_NAME: Diodes Inc
U$1 U$3 = circuitects:ADS1220
U$2 = 125SH-G-03-TR-SMT:125SH-G-03-TR-SMT
Y1 = ECS-80-18-33-JGN-TR:ECS-80-18-33-JGN-TR: The sub miniature ECX-32 is a compact SMD Crystal. The 3.2 x 2.5 x 0.8 mm ceramic package is ideal for today’s SMD manufacturing environment.; AVAILABILITY: Good; DESCRIPTION: The sub miniature ECX-32 is a compact SMD Crystal.; MF: ECS INC; MP: ECX-32; PACKAGE: SMD-4 ECX; STANDARD: Manufacturer recommendations

## Net classes
1 CAN: width 0.152 mm, clearance 0.229 mm

## Board
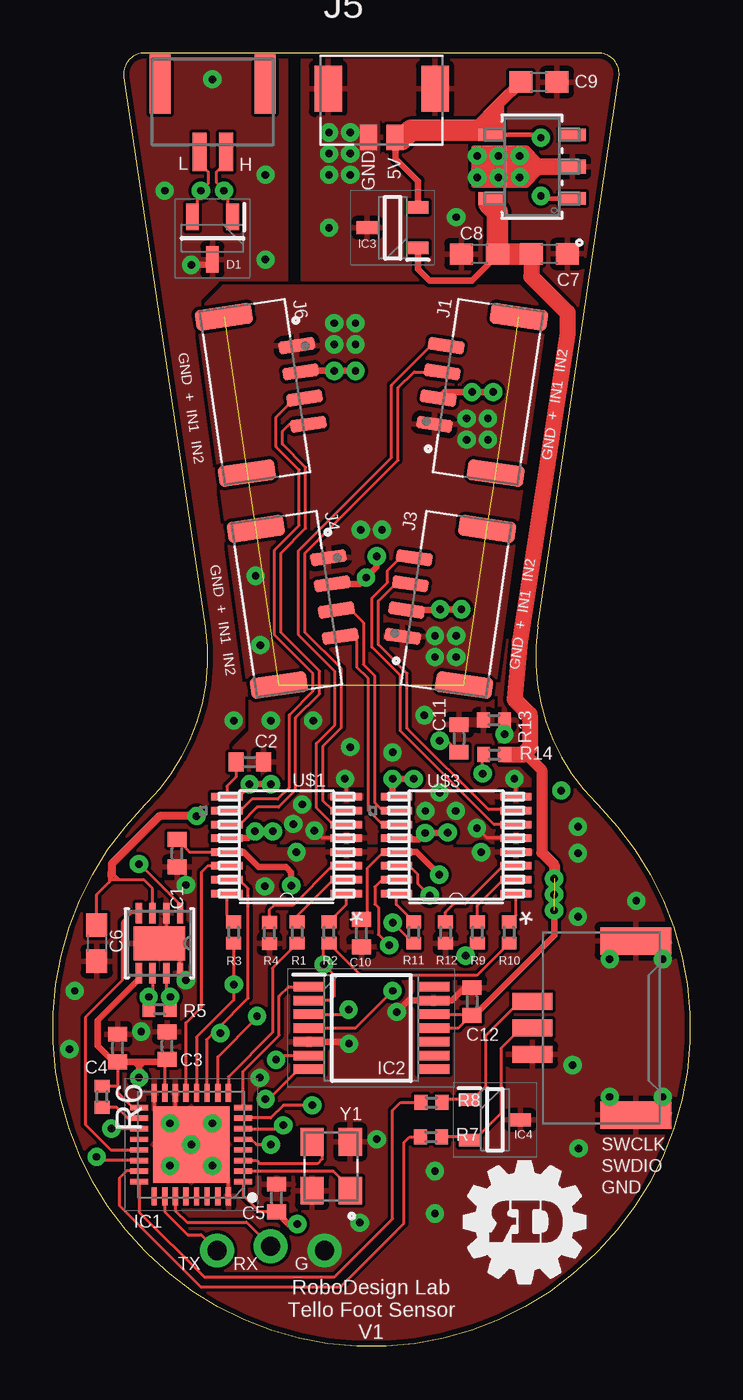
[diagram p6: board, top side]
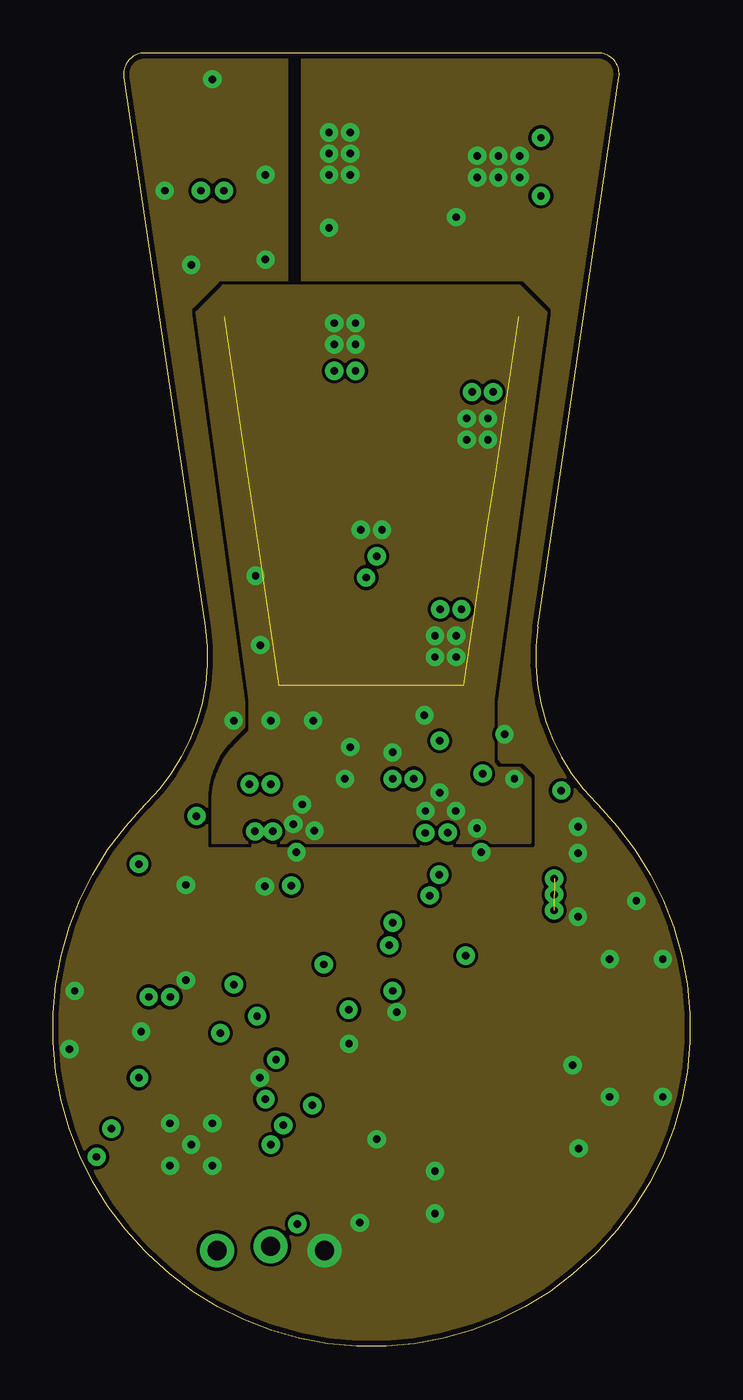
[diagram p7: board, inner layer Route2]
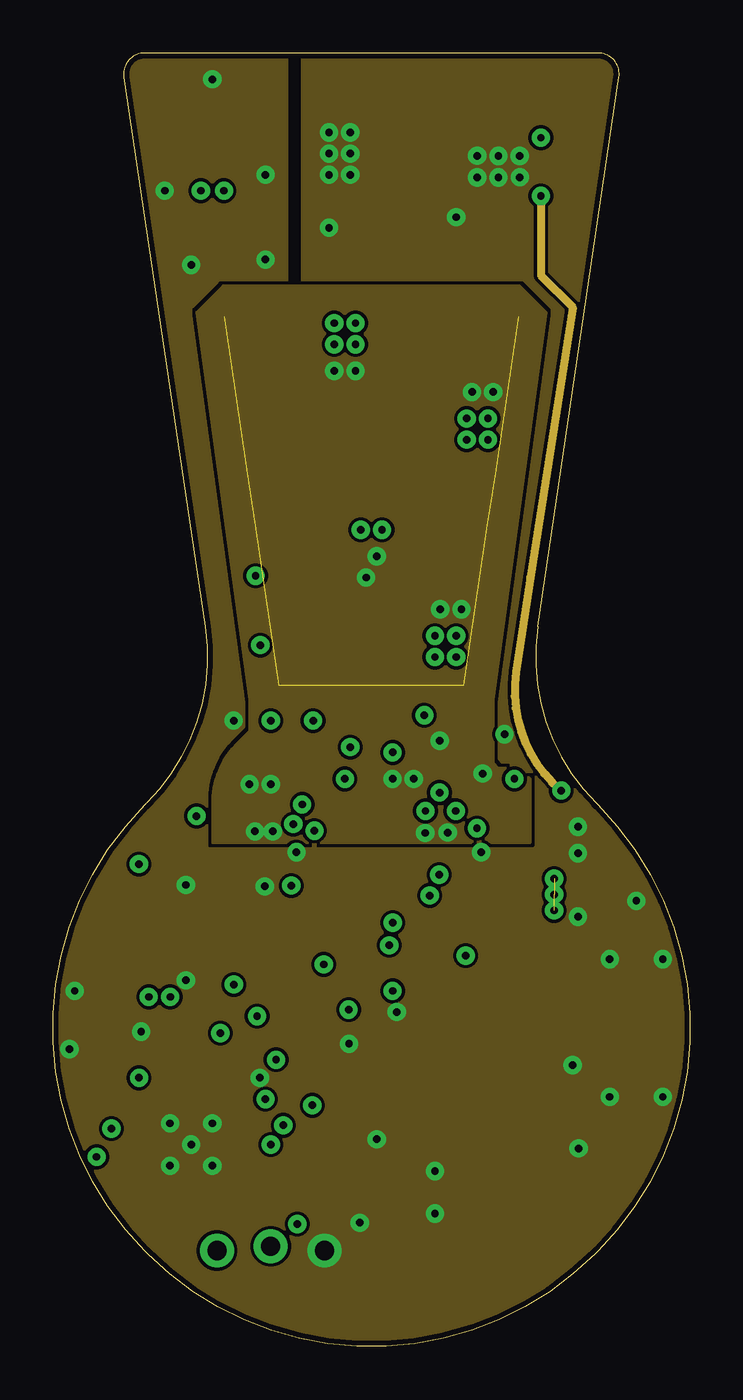
[diagram p8: board, inner layer Route15]
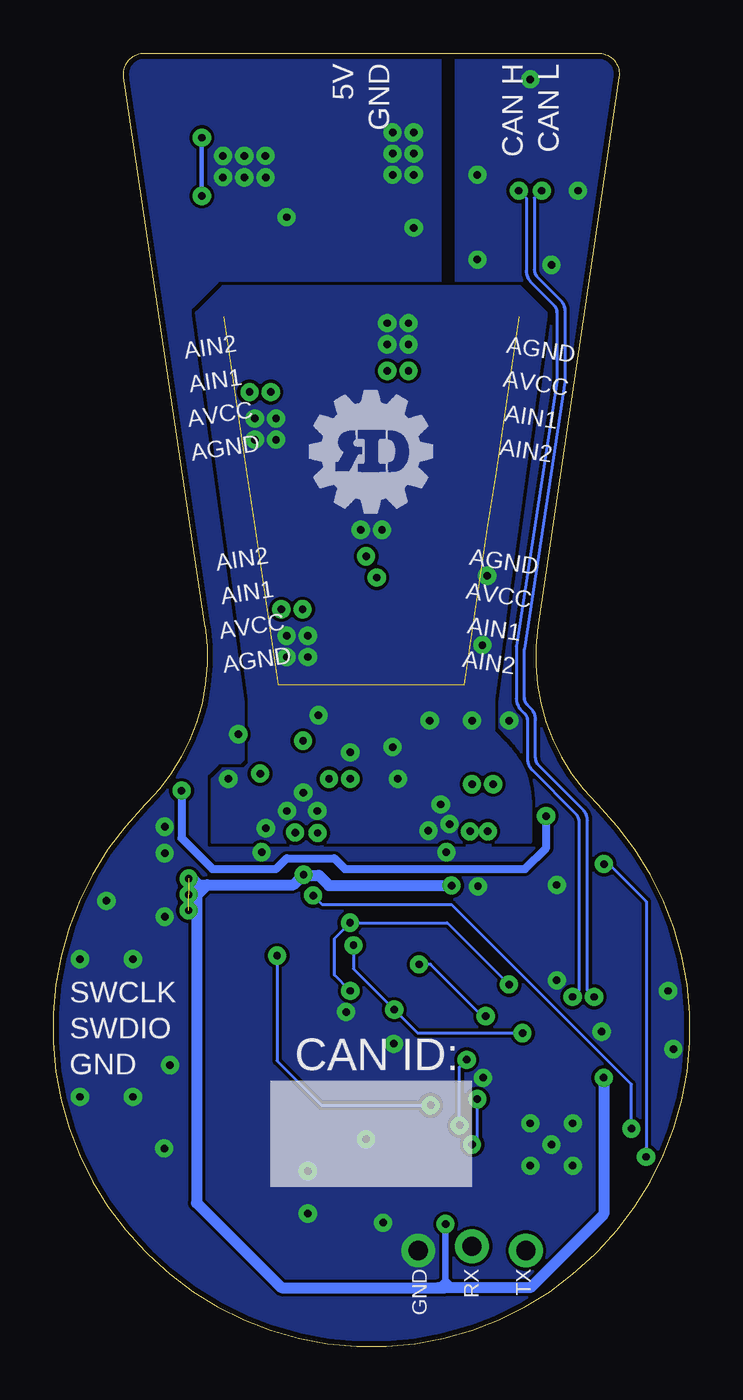
[diagram p9: board, bottom side, seen from below]

Size 30.05 x 61.02 mm. Coordinates in mm from the lower left corner, seen from the top.
Outline: 22.88,33.96 26.71,59.87 arc98 25.72,61.02 4.33,61.02 arc98 3.34,59.87 7.17,33.96 arc-53 4.42,25.63 4.35,25.56 arc90 4.35,4.49 4.49,4.35 arc90 25.56,4.35 25.7,4.49 arc90 25.7,25.56 25.63,25.63 arc-53 22.88,33.96
Copper layers (1+2*15+16): Top 0.035mm / dielectric 1.5mm / Route2 0.035mm / dielectric 0.15mm / Route15 0.035mm / dielectric 0.2mm / Bottom 0.035mm
Design rules "Circuitects-Rules *": minimum track width 6mil, minimum drill 0.3mm, track to track 6mil, track to pad 6mil, pad to pad 6mil, via to via 6mil, smd to smd 6mil, copper to edge 10mil, drill to drill 8mil, minimum pad ring 12mil, minimum via ring 10mil, stop-mask expansion 4mil, vias tented up to drill 25mil, thermal gap 10mil

### Footprints (pad centres in the part's own frame; a part is rotated, then mirrored left to right if it is on the bottom)
C0402 = smd 0.7 x 0.9: 1 -0.65,0; 2 0.65,0
C0603 = smd 1.1 x 1: 1 -0.85,0; 2 0.85,0
SOT95P230X117-3N = smd 1.25 x 0.6: 1 -1,0.95; 2 -1,-0.95; 3 1,0
QFN50P500X500X60-33N = smd 0.85 x 0.25: 1 -2.45,1.75; 2 -2.45,1.25; 3 -2.45,0.75; 4 -2.45,0.25; 5 -2.45,-0.25; 6 -2.45,-0.75; 7 -2.45,-1.25; 8 -2.45,-1.75; 17 2.45,-1.75; 18 2.45,-1.25; 19 2.45,-0.75; 20 2.45,-0.25; 21 2.45,0.25; 22 2.45,0.75; 23 2.45,1.25; 24 2.45,1.75 | smd 0.25 x 0.85: 9 -1.75,-2.45; 10 -1.25,-2.45; 11 -0.75,-2.45; 12 -0.25,-2.45; 13 0.25,-2.45; 14 0.75,-2.45; 15 1.25,-2.45; 16 1.75,-2.45; 25 1.75,2.45; 26 1.25,2.45; 27 0.75,2.45; 28 0.25,2.45; 29 -0.25,2.45; 30 -0.75,2.45; 31 -1.25,2.45; 32 -1.75,2.45 | smd 3.6 x 3.6: 33 0,0
SOP65P640X120-14N = smd 1.475 x 0.45: 1 -2.938,1.95; 2 -2.938,1.3; 3 -2.938,0.65; 4 -2.938,0; 5 -2.938,-0.65; 6 -2.938,-1.3; 7 -2.938,-1.95; 8 2.938,-1.95; 9 2.938,-1.3; 10 2.938,-0.65; 11 2.938,0; 12 2.938,0.65; 13 2.938,1.3; 14 2.938,1.95
SOT96P237X111-3N = smd 1 x 0.6: 1 -1.2,0.955; 2 -1.2,-0.955; 3 1.2,0
JST_SM04B-GHS-TB(LF)(SN)- = smd 0.6 x 1.7: 1 -1.875,2.275; 2 -0.625,2.275; 3 0.625,2.275; 4 1.875,2.275 | smd 1 x 2.7: SH1 -3.725,-0.925; SH2 3.725,-0.925
CONN_SM02BGHSTB_JST = smd 0.66 x 1.803: 1 -0.625,2.345; 2 0.625,2.345 | smd 0.991 x 2.794: 3 -2.475,-0.865; 4 2.475,-0.865
MOLEX_5055670271 = smd 0.8 x 1.2: 1 0.625,-1.75; 2 -0.625,-1.75 | smd 1.3 x 2.15: S1 -2.525,0.545; S2 2.525,0.545
R0402 = smd 0.6 x 0.7: 1 -0.5,0; 2 0.5,0
DFN8_3X3MC_MCH-M = smd 0.965 x 0.305: 1 -1.422,0.975; 2 -1.422,0.325; 3 -1.422,-0.325; 4 -1.422,-0.975; 5 1.422,-0.975; 6 1.422,-0.325; 7 1.422,0.325; 8 1.422,0.975 | smd 1.6 x 2.413: 9 0,0
SOT89-5_DIO-M = smd 0.583 x 1.24: 1 -1.5,-1.915; 3 1.5,-1.915; 4 1.5,1.915; 5 -1.5,1.915 | smd 0.66 x 1.24: 2 0,-1.915
TSSOP-16 = smd 1.473 x 0.356: 1 -2.819,2.656; 2 -2.819,1.996; 3 -2.819,1.335; 4 -2.819,0.7; 5 -2.819,0.04; 6 -2.819,-0.595; 7 -2.819,-1.256; 8 -2.819,-1.916; 9 2.819,-1.916; 10 2.819,-1.256; 11 2.819,-0.595; 12 2.819,0.04; 13 2.819,0.7; 14 2.819,1.335; 15 2.819,1.996; 16 2.819,2.656
125SH-G-03-TR-SMT = smd 0.8 x 1.9: 1 1.25,0; 2 0,0; 3 -1.25,0 | smd 1.3 x 3.35: SH1 4.1,-4.875; SH2 -4.1,-4.875
XTAL_ECS-240-8-33-AGN-TR = smd 1.3 x 1.1: 1 -1.15,-0.9; 2 1.15,-0.9; 3 1.15,0.9; 4 -1.15,0.9

### Placement (x,y rotation side)
C1  5.86,23.27 270 top
C2  9.29,27.57 0 top
C3  5.38,14.19 90 top
C4  3.04,14.08 90 top
C5  10.54,7.01 90 top
C6  2.07,19.03 270 top
C7  23.43,51.55 0 top
C8  20.13,51.54 180 top
C9  22.93,59.65 0 top
C10  14.55,19.5 270 top
C11  19.16,28.68 90 top
C12  19.78,16.28 90 top
D1  7.53,52.28 270 top
IC1  6.53,9.53 180 top
IC2  15.03,15.03 0 top
IC3  16.03,52.78 180 top
IC4  20.86,10.7 0 top
J1  20.53,45.03 81.6 top
J2  7.54,58.7 180 top
J3  19.03,35.03 81.6 top
J4  11.03,35.03 278.4 top
J5  15.51,58.79 0 top
J6  9.53,45.03 278.4 top
R1  11.53,19.53 90 top
R2  13.03,19.53 90 top
R3  8.53,19.53 90 top
R4  10.22,19.51 90 top
R5  5.03,15.91 0 top
R6  2.32,11.79 270 top
R7  17.84,9.89 0 top
R8  17.86,11.52 0 top
R9  20.03,19.53 90 top
R10  21.53,19.53 90 top
R11  17.03,19.53 90 top
R12  18.53,19.53 90 top
R13  20.81,29.55 0 top
R14  20.83,27.92 0 top
U1  5.03,19.03 270 top
U2  22.61,55.66 90 top
U$1  11.03,24.03 180 top
U$2  22.63,15.03 90 top
U$3  19.03,24.03 180 top
Y1  13.13,8.5 90 top

### Tracks (layer width: path | path; a pad name or v marks a point on that pad's centre or on a via)
3V3  (via drill 0.35)  (2 unrouted)
  Top 0.152: C10.1 14.82,20.42 14.82,22.56 15.59,23.33 U$3.13 | C1.1 6.45,23.33 U$1.13 | C5.1 9.74,6.36 8.98,7.13 IC1.1 | C3.1 5.28,13.43 IC1.15 | C4.1 3.04,12.28 | 3.04,12.28 3.04,11.98 3.75,11.28 IC1.17 | U2.5 20.69,54.02 20.58,53.9 | IC2.12 19.73,15.68 | 19.73,15.68 C12.1 | IC2.11 19.13,15.03 19.73,15.62 19.73,15.68 | R6.1 3.03,12.29 3.04,12.28
  Top 0.305: U$1.13 9,23.33 9.71,22.61 10.99,22.61 11.24,22.36 v11.24,21.74 | v18.23,22.25 17.15,23.33 U$3.13 | C3.1 5.28,13.43 4.28,13.43 | 4.28,13.43 4.07,13.43 | 4.07,13.43 3.84,13.43 | 3.84,13.43 C4.1 2.87,13.43 2.12,14.18 2.12,15.39 4.05,17.33 U1.5 | 4.07,13.43 4.07,13.22 | 4.07,13.22 v4.07,12.68 v4.06,12.67 4.06,13.22 3.84,13.43 | v23.65,22.07 23.65,19.38 19.89,15.63 C12.1 | C5.1 11.13,5.78 v11.53,5.78 | 4.28,13.43 4.07,13.22 | IC3.1 17.23,50.82 17.77,50.28 19.78,50.28 20.98,51.48 C8.1
  Top 0.508: R14.2 22.34,27.92 23.06,27.2 23.06,23.3 23.65,22.71 v23.65,22.07
  Top 0.762: C7.1 22.58,50.48 24.28,48.78 24.28,47.78 22.03,33.28 21.78,30.53 22.48,29.82 22.53,29.69 22.53,28.28 22.17,27.92 R14.2
  Top 1.016: C7.1 C8.1 20.98,53.5 20.58,53.9
  Bottom 0.305: 11.53,2.78 11.53,3.13 | v11.53,5.78 11.53,3.15 | 11.53,3.15 11.15,2.78 | 11.53,3.15 11.53,3.13 | 11.53,3.13 11.88,2.78
  Bottom 0.508: 22.78,21.78 18.7,21.78 v18.23,22.25 18.2,22.22 17.5,22.22 17.03,21.74 v11.24,21.74 | v4.06,12.67 4.06,6.24 7.53,2.78 11.15,2.78 11.53,2.78 11.88,2.78 19.28,2.78 23.28,6.78 23.28,21.28 | 23.28,21.28 22.78,21.78 | 23.28,21.28 23.28,21.7 | 23.36,21.78 22.78,21.78
  Bottom 0.762: 23.28,21.7 v23.65,22.07 23.36,21.78
  other vias: 23.65,21.32 23.65,20.57
5V  (via drill 0.35)
  Top 0.152: C6.1 2.07,21.32 2.66,21.91 | 2.78,22.03 3.03,22.03 | 3.13,22.03 4.28,22.03 4.7,21.6 U1.3 | 2.78,22.28 2.78,22.03 | 2.78,22.03 2.66,21.91 | 2.66,22.16 2.66,21.91 | 2.78,22.28 2.66,22.16 | 2.66,22.16 2.66,22.41 2.78,22.53 | 2.78,22.28 3.03,22.03 | 3.03,22.03 3.13,22.03 | 3.13,22.03 2.78,22.38 | J5.1 16.17,57.04 16.36,57.04 16.45,56.94
  Top 0.203: U2.4 21.03,57.16 22.9,57.16 v23.03,57.03 | v23.03,54.28 23.15,54.16 U2.1
  Top 0.305: 16.17,57.04 16.17,56.04 17.23,54.98 IC3.2
  Top 0.381: v6.78,25.03 5.03,25.03 2.78,22.78 2.78,22.53 2.78,22.38 2.78,22.28
  Top 0.508: C9.1 21.03,58.59 | 21.03,58.59 21.03,57.16 | 21.03,58.59 19.94,57.51 20.69,57.51
  Top 1.016: 20.69,57.51 20.55,57.37 16.88,57.37 16.45,56.94
  Route15 0.381: v23.03,54.28 23.03,50.53 24.53,49.03 22.53,36.28 21.86,31.81 arc59 v23.98,26.22
  Bottom 0.203: v23.03,57.03 v23.03,54.28
  Bottom 0.381: v6.78,25.03 6.78,23.53 7.78,22.53 16.28,22.53 16.78,23.03 19.03,23.03 19.53,22.53 22.53,22.53 23.98,23.98 v23.98,26.22
AGND  (via drill 0.35)
  Top 0.152: U$1.5 12.68,23.99 v12.34,24.33 | U$1.8 13.84,26.71 v13.78,26.78 | U$3.8 21.84,26.71 v21.78,26.78 | U$3.5 20.47,23.99 v20,24.45
  other vias: 10.28,29.53 12.28,29.53 14.03,28.28 16.03,28.03 17.53,29.78 18.24,26.13 19.01,25.26 17.58,25.26 11.34,24.64 11.76,25.57 18.03,33.53 19.03,33.53 19.03,32.53 18.03,32.53 14.53,38.53 15.53,38.53 13.28,48.28 13.28,47.28 14.28,47.28 14.28,48.28 19.53,43.78 20.53,43.78 20.53,42.78 19.53,42.78 9.79,33.09 9.56,36.36
  pour Top (rank 2): 23.28,48.78 22.03,50.03 8.03,50.03 6.78,48.78 9.28,30.53 9.28,29.03 8.7,28.45 arc45 7.53,25.62 7.53,23.78 22.53,23.78 22.53,26.78 22.28,27.03 22.03,27.28 21.28,27.28 21.03,27.28 20.78,27.53 20.78,30.53
  pour Route2 (rank 2): 23.28,48.78 22.03,50.03 8.03,50.03 6.78,48.78 9.28,30.53 9.28,29.03 8.7,28.45 arc45 7.53,25.62 7.53,23.78 22.53,23.78 22.53,26.78 22.03,27.28 21.03,27.28 20.78,27.53 20.78,30.53
  pour Bottom (rank 2): 23.28,48.78 22.03,50.03 8.03,50.03 6.78,48.78 9.28,30.53 9.28,29.03 8.7,28.45 arc45 7.53,25.62 7.53,23.78 22.53,23.78 22.53,26.78 22.03,27.28 21.03,27.28 20.78,27.53 20.78,30.53
AIN0_1
  Top 0.152: U$1.11 8.82,24.62 9.64,25.44 10.66,25.44 11.46,26.24 11.46,29.66 12.58,30.79 12.58,31.86 10.75,33.69 10.75,37.43 11.93,38.6 11.93,41.47 10.83,42.56 10.83,43.17 11.16,43.5 J6.4
AIN0_2
  Top 0.152: U$3.11 15.55,24.62 14.88,25.29 14.88,31.51 14.33,32.06 14.33,33.29 14.12,33.5 J4.4
AIN1_1
  Top 0.152: U$1.10 8.85,25.28 9.39,25.82 10.6,25.82 11.15,26.37 11.15,29.8 12.27,30.92 12.27,31.74 10.45,33.56 10.45,37.57 11.62,38.74 11.62,41.34 10.53,42.44 10.53,43.84 11.43,44.74 J6.3
AIN1_2
  Top 0.152: U$3.10 15.55,25.28 15.19,25.65 15.19,31.63 14.64,32.18 14.64,34.15 14.05,34.74 J4.3
AIN2_1
  Top 0.152: U$1.7 13.2,25.28 12.74,25.75 12.74,28.33 13.61,29.2 13.61,31.97 11.89,33.69 11.89,37.42 16.28,41.81 16.28,45.23 17.04,45.98 J1.3
AIN2_2
  Top 0.152: U$3.7 21.8,25.32 20.55,25.32 16.71,29.16 16.71,31.76 15.36,33.11 15.36,35.17 16.16,35.98 J3.3
AIN3_1
  Top 0.152: U$1.6 13.23,24.62 12.44,25.41 12.44,28.45 13.31,29.32 13.31,31.84 11.59,33.56 11.59,37.55 15.98,41.94 15.98,45.35 17.84,47.21 J1.4
AIN3_2
  Top 0.152: U$3.6 20.82,24.62 16.4,29.04 16.4,31.64 15.05,32.99 15.05,35.3 15.78,36.03 15.79,36.08 15.79,36.61 16.4,37.21 J3.4
AVDD  (via drill 0.35)
  Top 0.152: C2.1 8.64,26.87 8.21,26.44 U$1.9 | 16.28,23.99 U$3.12 | v20.28,27.03 20.28,27.87 R14.1 | C11.1 18.62,28.57 v18.25,28.57
  Top 0.305: U$1.12 9.22,23.99 v9.53,24.3 10.26,24.3 v10.37,24.3 | v18.62,24.24 18.61,24.23 v17.57,24.23 17.27,23.93 16.95,23.93 16.89,23.99 16.28,23.99 | U$3.9 16.03,26.12 v16.03,26.78 v17.03,26.78 | U$1.9 8.69,25.94 v9.28,26.53 v10.28,26.53 | J4.2 14.48,35.98 v14.78,36.28 15.28,36.78 v15.28,37.28 | J3.2 18.24,34.74 v18.28,34.78 v19.28,34.78 | J1.2 18.47,45.03 v19.78,45.03 v20.78,45.03 | J6.2 11.73,46.03 v13.28,46.03 v14.28,46.03
  pour Route15 (rank 2): 23.28,48.78 22.03,50.03 8.03,50.03 6.78,48.78 9.28,30.53 9.28,29.03 8.7,28.45 arc45 7.53,25.62 7.53,23.78 22.53,23.78 22.53,26.78 22.03,27.28 21.03,27.28 20.78,27.53 20.78,30.53
CAN_N  (via drill 0.35)
  Top 0.152: U1.6 4.7,16.67 v4.52,16.49 4.53,16.48 R5.1 | D1.2 6.8,53.5 6.8,54.34 v6.98,54.52 v6.98,54.53 v6.98,54.54 7.33,54.89 7.33,55.41 6.91,55.83 J2.2
  Bottom 0.152: v4.52,16.49 4.83,16.81 4.83,24.81 arc-45 5.05,25.34 7.13,27.42 arc45 7.28,27.77 7.28,29.57 arc-45 7.5,30.1 7.66,30.26 arc45 7.8,30.61 7.8,32.9 5.89,45.53 5.89,48.83 arc-45 6.11,49.36 7.19,50.44 arc45 7.33,50.79 7.33,54.17 v6.98,54.53
CAN_P  (via drill 0.35)
  Top 0.152: v5.53,16.49 5.35,16.67 U1.7 | R5.2 v5.53,16.49 | v5.53,16.49 | D1.1 8.25,53.5 8.25,54.37 7.86,54.76 | 7.86,54.76 7.72,54.9 7.72,55.42 8.16,55.86 J2.1 | 7.86,54.76 7.86,54.74 v8.07,54.53
  Bottom 0.152: v5.53,16.49 5.22,16.8 5.22,24.76 arc-45 5.37,25.12 7.44,27.19 arc45 7.66,27.72 7.66,29.51 arc-45 7.8,29.87 7.96,30.03 arc45 8.18,30.56 8.18,33.04 6.28,45.53 6.28,48.78 arc-45 6.42,49.13 7.5,50.21 arc45 7.72,50.74 7.72,54.17 v8.07,54.53
CS1
  Top 0.152: R1.1 10.36,17.86 10.36,14.81 8.28,12.73 IC1.9
CS2  (via drill 0.35)
  Top 0.152: R9.1 | v19.48,18.44 19.48,18.48 R9.1 | v12.23,11.38 10.88,11.38 10.28,10.78 IC1.7
  Bottom 0.152: v19.48,18.44 19.48,13.48 17.38,11.38 v12.23,11.38
DRDY_1
  Top 0.152: IC1.13 6.28,15.28 7.03,16.03 7.03,22.39 7.33,22.69 U$1.14
DRDY_2  (via drill 0.35)
  Top 0.152: IC1.19 v2.76,10.28 | v17.78,21.28 17.21,21.84 17.21,22.29 16.81,22.69 U$3.14
  Bottom 0.152: v2.76,10.28 2.76,12.37 11.22,20.84 17.34,20.84 v17.78,21.28
ENC_A  (via drill 0.35)
  Top 0.152: IC1.5 9.36,9.77 9.61,9.53 v10.28,9.53 | v10.03,11.67 10.18,11.67 11.59,13.08 IC2.7
  Bottom 0.152: v10.28,9.53 10.03,9.78 v10.03,11.67
ENC_B  (via drill 0.35)
  Top 0.152: IC1.6 10.71,10.28 v10.87,10.44 | v10.53,13.53 10.73,13.73 IC2.6
  Bottom 0.152: v10.87,10.44 10.87,13.19 v10.53,13.53
ENC_CS
  Top 0.152: IC2.1 11.12,16.98 10.68,16.54 10.68,14.69 8.98,12.98 IC1.8
FDCAN_RX
  Top 0.152: U1.4 3.7,20.45 3.28,20.03 3.28,17.28 1.53,15.53 1.53,10.47 2.72,9.28 IC1.21
FDCAN_TX  (via drill 0.35)
  Top 0.152: IC1.22 2.23,8.78 v2.06,8.95 | U1.1 6,20.86 4.1,22.76 v4.05,22.76
  Bottom 0.152: v2.06,8.95 2.06,20.99 3.83,22.76 v4.05,22.76
GND  (via drill 0.35, 0.9 pad 1.6)
  Top 0.152: U1.2 5.35,19.35 U1.9 6.03,19.03 6,19 U1.8 | IC1.14 5.78,10.78 v5.53,10.53 4.78,11.28 IC1.16 | IC1.32 8.28,7.78 v7.53,8.53 | R13.2 v21.31,28.89 v21.31,28.88 | C1.2 6.28,22.2 v6.28,21.78
  Top 0.305: v16.22,15.78 16.77,16.33 IC2.13 18.83,16.33 19.43,16.93 C12.2 | IC2.5 13.87,14.38 v13.97,14.28 | D1.3 7.28,51.03 v6.53,51.03
  other vias: 15.28,9.78 14.48,5.84 18.03,8.28 18.03,6.28 24.8,9.35 26.28,11.78 28.78,11.78 26.28,18.28 28.78,18.28 24.53,13.28 7.53,10.53 5.53,8.53 6.53,9.53 1.03,16.78 6.28,17.28 11.49,23.32 10,21.71 20.21,23.32 24.78,24.53 24.78,23.28 24.78,20.28 27.53,21.03 0.78,14.03 4.16,14.86 9.76,12.68 10.03,51.28 5.28,54.53 7.53,59.78 10.03,55.28 8.53,29.53 12.82,4.53 19.03,53.28 13.03,52.78 20.02,56.17 22.03,56.16 22.03,55.16 21.02,55.15 20.02,55.15 21.02,56.17 14.03,57.28 14.03,56.28 14.03,55.28 13.03,55.28 13.03,56.28 13.03,57.28
  pour Top (rank 5): -4.47,63.53 11.03,63.53 11.03,49.78 11.78,49.78 11.78,63.53 39.28,63.53 44.03,58.78 44.03,7.78 34.03,-2.22 -3.72,-2.22 -9.97,4.03 -9.97,58.03
  pour Route2 (rank 5): -4.22,63.28 11.03,63.28 11.03,49.78 11.78,49.78 11.78,63.28 39.53,63.28 44.28,58.53 44.28,7.53 34.28,-2.47 -3.47,-2.47 -9.72,3.78 -9.72,57.78
  pour Route15 (rank 5): -3.97,63.03 11.03,63.03 11.03,49.78 11.78,49.78 11.78,63.03 39.78,63.03 44.53,58.28 44.53,7.28 34.53,-2.72 -3.22,-2.72 -9.47,3.53 -9.47,57.53
  pour Bottom (rank 5): -3.72,62.78 11.03,62.78 11.03,49.78 11.78,49.78 11.78,62.78 40.03,62.78 44.78,58.03 44.78,7.03 34.78,-2.97 -2.97,-2.97 -9.22,3.28 -9.22,57.28
  pour Top (no thermals): 12.53,58.03 15.17,58.03 15.36,57.83 15.36,55.04 15.15,54.83 12.78,54.83 12.39,55.22 12.39,57.9 12.51,58.02
GPIO4_RX  (via drill 0.9 pad 1.6)
  Top 0.152: IC1.27 5.78,6.41 6.32,5.86 9.13,5.86 v10.28,4.73
GPIO5_TX  (via drill 0.9 pad 1.6)
  Top 0.152: IC1.26 5.28,6.36 6.36,5.28 6.99,5.28 v7.74,4.53
ID_PIN
  Top 0.152: IC1.18 3.51,10.78 3,11.29 R6.2
MISO  (via drill 0.35)
  Top 0.152: IC1.11 7.24,12.01 7.24,14.47 7.74,14.97 | U$1.15 8.77,22.03 9.02,21.78 9.04,21.78 9.21,21.61 9.21,16.43 7.74,14.97 | U$3.15 15.54,22.03 15.19,21.68 15.19,20.87 15.36,20.71 15.36,19.44 v15.87,18.93 | v7.9,14.79 7.74,14.94 7.74,14.97 | IC2.3 13.73,15.68 v13.95,15.89
  Bottom 0.152: v15.87,18.93 15.87,17.81 v13.95,15.89 12.84,14.79 v7.9,14.79
MOSI  (via drill 0.35)
  Top 0.152: IC1.12 6.78,14.6 8.53,16.35 R3.1 v8.53,17.08 | R11.1 17,19.03 v16.03,19.99 | IC2.4 14.28,15.03 v16.03,16.78
  Bottom 0.152: v8.53,17.08 11.45,19.99 v16.03,19.99 16.78,19.25 16.78,17.53 v16.03,16.78
N$1
  Top 0.152: R11.2 16.21,20.84 U$3.16
N$2
  Top 0.152: R10.2 21.84,20.34 U$3.1
N$3
  Top 0.152: R3.2 8.21,20.34 U$1.16
N$4
  Top 0.152: R2.2 13.84,20.84 U$1.1
N$5
  Top 0.152: R1.2 11.53,20.32 13.23,22.03 U$1.2
N$6
  Top 0.152: R9.2 20.03,20.81 21.25,22.03 U$3.2
N$7
  Top 0.152: U$1.3 13.2,22.69 11.33,20.82 10.43,20.82 10.22,20.61 R4.2
N$8
  Top 0.152: U$3.3 21.25,22.69 19.46,20.9 18.92,20.9 18.53,20.5 R12.2
OSC_IN
  Top 0.152: IC1.2 13.21,8.28 14.03,7.46 Y1.1
OSC_OUT
  Top 0.152: Y1.3 12.71,9.18 12.71,8.84 12.48,8.62 9.76,8.62 9.6,8.78 IC1.3
SCK  (via drill 0.35)
  Top 0.152: R10.1 20.01,17.51 14.54,17.51 R2.1 12.78,18.78 v12.78,18.03 13.27,17.53 13.27,16.53 13.07,16.33 IC2.2 | IC1.10 7.78,13.67 9.63,15.52 v9.63,15.58
  Bottom 0.152: v9.63,15.58 9.71,15.5 12.24,18.03 v12.78,18.03
SHIELD  (7 unrouted)
SWCLK
  Top 0.152: IC1.24 4.08,6.34 7.14,3.28 13.28,3.28 16.03,6.03 16.03,11.14 16.4,11.52 R8.1
SWCLK_C
  Top 0.152: U$2.1 22.03,16.28 20.43,14.67 20.43,12.28 19.8,11.65 IC4.1 18.49,11.65 R8.2
SWDIO
  Top 0.152: IC1.23 3.47,8.28 3.13,7.93 3.13,6.66 6.96,2.83 13.57,2.83 16.56,5.81 16.56,9.62 16.83,9.89 R7.1
SWDIO_C
  Top 0.152: U$2.2 22.1,15.03 21.14,14.07 21.14,10.99 19.9,9.74 IC4.2 19.51,9.89 R7.2

### Text on the board
tPlace: L | H | GND | 5V | GND + IN1 IN2 | GND + IN1 IN2 | GND + IN1 IN2 | GND + IN1 IN2 | SWCLK / SWDIO / GND | TX | RX | G | RoboDesign Lab / Tello Foot Sensor / V1
bPlace: CAN H / CAN L | 5V / GND | AGND / AVCC / AIN1 / AIN2 | AIN2 / AIN1 / AVCC / AGND | AGND / AVCC / AIN1 / AIN2 | AIN2 / AIN1 / AVCC / AGND | SWCLK / SWDIO / GND | CAN ID: | GND / RX / TX